# EasyEDA Pro project H桥.eprj

# Schematic 单相_直插
Board Name: 单相_直插; Create Date: 2025-08-05; Page Name: P1; Project Name: H桥; Schematic Name: 单相_直插; Update Date: 2025-08-12; Company: 嘉立创EDA; Page Size: A4; Version: V1.0
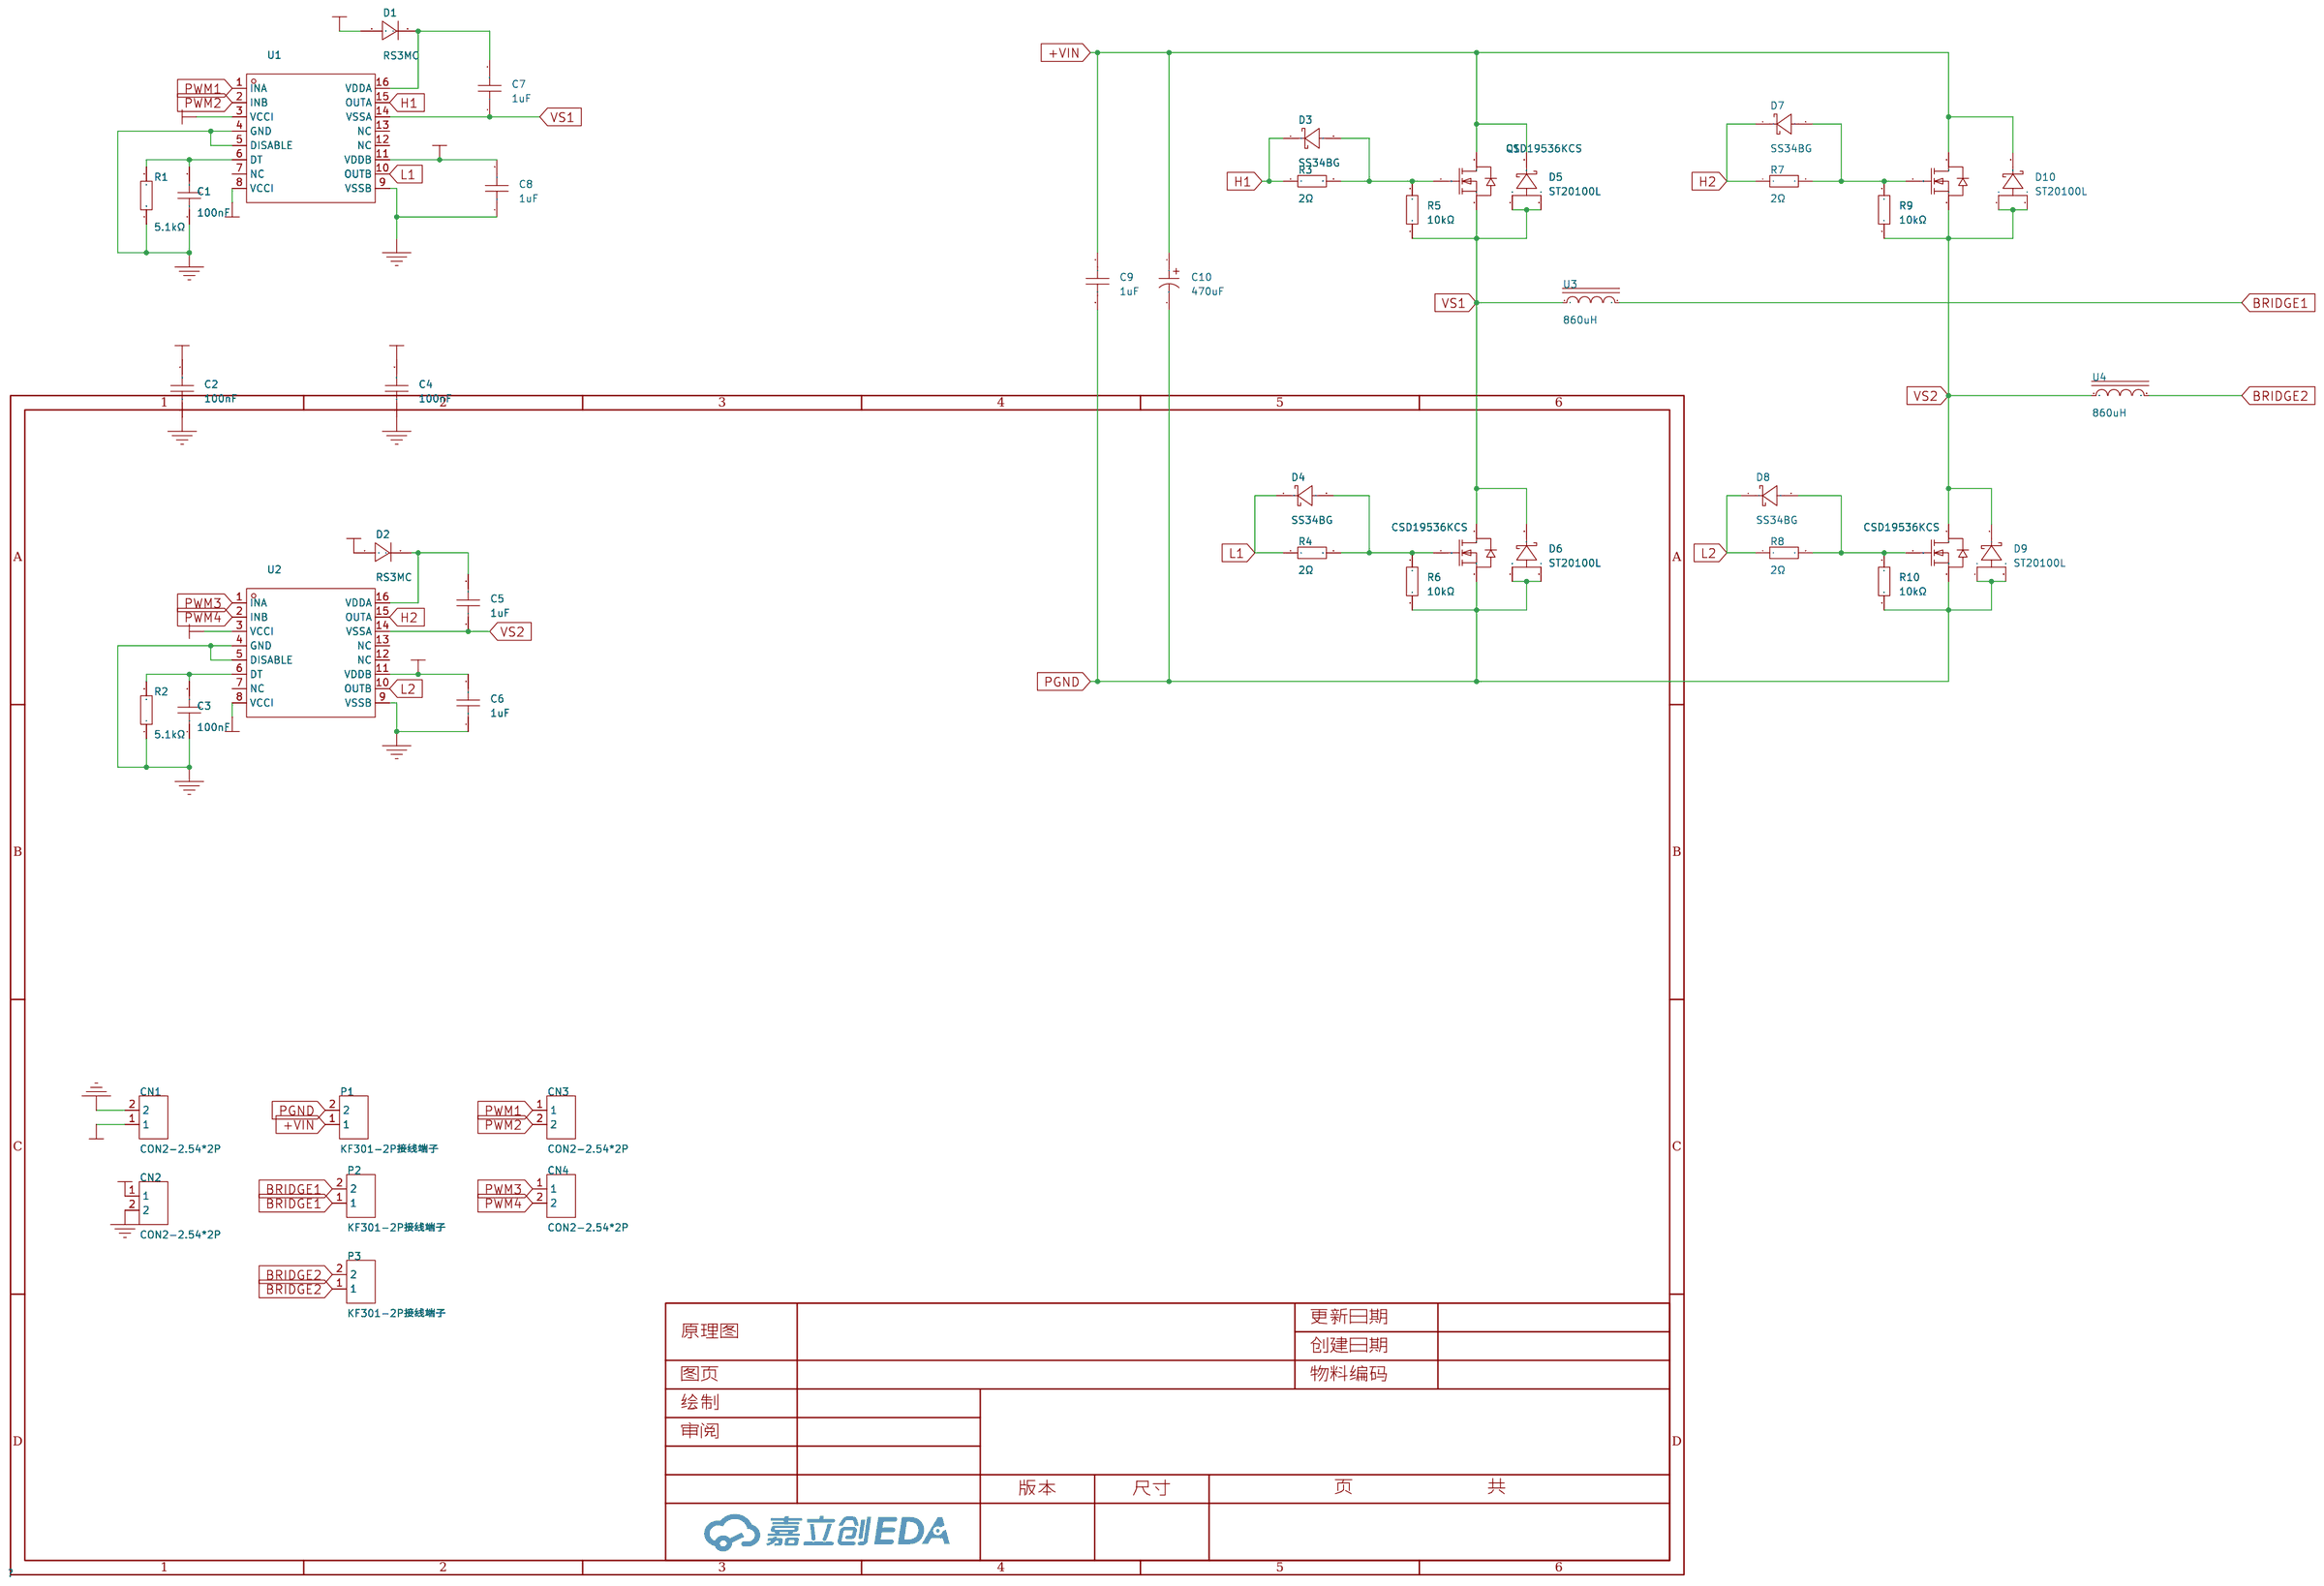
[diagram p0: schematic sheet]

## Parts
C1  100nF  [C0805]
C2  100nF  [C0805]
C3  100nF  [C0805]
C4  100nF  [C0805]
C5  1uF  [C0805]
C6  1uF  [C0805]
C7  1uF  [C0805]
C8  1uF  [C0805]
C9  1uF  [CAP-TH_L26.5-W10.0-P22.50-D1.4]
C10  470uF  [CAP-TH_BD16.0-P7.50-D1.2-FD]
CN1  CON2-2.54*2P  [CONN-TH_2P-P2.54-V]
CN2  CON2-2.54*2P  [CONN-TH_2P-P2.54-V]
CN3  CON2-2.54*2P  [CONN-TH_2P-P2.54-V]
CN4  CON2-2.54*2P  [CONN-TH_2P-P2.54-V]
D1  RS3MC  [SMC_L7.1-W6.2-LS8.1-R-RD]
D2  RS3MC  [SMC_L7.1-W6.2-LS8.1-R-RD]
D3  SS34BG  [SMB_L4.6-W3.6-LS5.3-RD]
D4  SS34BG  [SMB_L4.6-W3.6-LS5.3-RD]
D5  ST20100L  [TO-277_3P-L5.7-W4.2-LS6.5-BR]
D6  ST20100L  [TO-277_3P-L5.7-W4.2-LS6.5-BR]
D7  SS34BG  [SMB_L4.6-W3.6-LS5.3-RD]
D8  SS34BG  [SMB_L4.6-W3.6-LS5.3-RD]
D9  ST20100L  [TO-277_3P-L5.7-W4.2-LS6.5-BR]
D10  ST20100L  [TO-277_3P-L5.7-W4.2-LS6.5-BR]
P1  KF301-2P接线端子  [CONN-TH_XY301V-A-5.0-2P]
P2  KF301-2P接线端子  [CONN-TH_XY301V-A-5.0-2P]
P3  KF301-2P接线端子  [CONN-TH_XY301V-A-5.0-2P]
Q1  CSD19536KCS  [TO-220-3_L10.0-W4.5-P2.54-L]
Q2  CSD19536KCS  [TO-220-3_L10.0-W4.5-P2.54-L]
Q3  CSD19536KCS  [TO-220-3_L10.0-W4.5-P2.54-L]
Q4  CSD19536KCS  [TO-220-3_L10.0-W4.5-P2.54-L]
R1  20kΩ  [R0805]
R2  20kΩ  [R0805]
R3  2Ω  [R0805]
R4  2Ω  [R0805]
R5  10kΩ  [R0805]
R6  10kΩ  [R0805]
R7  2Ω  [R0805]
R8  2Ω  [R0805]
R9  10kΩ  [R0805]
R10  10kΩ  [R0805]
U1  UCC21520  [SOIC-16_L10.3-W7.5-P1.27-LS10.3-BL]
U2  UCC21520  [SOIC-16_L10.3-W7.5-P1.27-LS10.3-BL]
U3  860uH  [IND-TH_L29.0-W16.0-P14.00-D0.8]
U4  860uH  [IND-TH_L29.0-W16.0-P14.00-D0.8]

## Library data of the parts
C1 C3 = 1C25X7R473K100B: 容值:47nF;精度:±10%;额定电压:100V;温度系数:X7R;; LCSC Part Name: 47nF ±10% 100V; Supplier Part: C1630512; Manufacturer: VISHAY(威世); Supplier Footprint: 插件,P=6.35mm; JLCPCB Part Class: Extended Part; Datasheet: https://atta.szlcsc.com/upload/public/pdf/source/20210701/0CF1A7AD3406E72B391D35880AF61B15.pdf; Supplier: LCSC; Tolerance: ±10%; Voltage Rated: 100V; Temperature Coefficient: X7R
C2 C4-C8 = CAP_0805: Supplier Footprint: 0805
C9 = C322J474J90C000: LCSC Part Name: 470nF ±5% 630V; Supplier Part: C401319; Manufacturer: faratronic(厦门法拉); Supplier Footprint: 插件,P=22.5mm; JLCPCB Part Class: 扩展库; Datasheet: https://atta.szlcsc.com/upload/public/pdf/source/20190702/C401136_4E449A5F5E1485A05AFFA403AF8D4B3E.pdf; Supplier: LCSC; Tolerance: ±5%; Voltage Rated: 630V
C10 = CD11Z 100V470μF: 容值:470uF;额定电压:100V;纹波电流:-;等效串联电阻:-;; LCSC Part Name: 470uF 100V; Supplier Part: C1692765; Manufacturer: DMEGC(东磁); Supplier Footprint: 插件,D16xL25mm; JLCPCB Part Class: 扩展库; Datasheet: https://atta.szlcsc.com/upload/public/pdf/source/20210111/C1692765_3DA9E861BF574BA4CB3EF792989E2CF7.pdf; Supplier: LCSC; Rated Voltage: 100V
CN1-CN4 = CON2-2.54*2P: Supplier Part: C9900003238; Supplier Footprint: TH-2P; JLCPCB Part Class: Extended Part; Supplier: LCSC
D1 D2 = RS3MC_C15283: 二极管配置:独立式;正向压降(Vf):1.3V@3A;直流反向耐压(Vr):1kV;整流电流:3A;反向恢复时间(trr):500ns;; LCSC Part Name: 电压:1kV 电流:3A; Supplier Part: C15283; Manufacturer: MDD(辰达半导体); Supplier Footprint: SMC; JLCPCB Part Class: 扩展库; Datasheet: https://atta.szlcsc.com/upload/public/pdf/source/20240809/311FA8487617F5AA976E3BC15CA3A541.pdf; Supplier: LCSC; Diode Configuration: 独立式; Forward Voltage (Vf@If): 1.3V@3A; Reverse Voltage (Vr): 1kV; Rectified Current: 3A; Reverse Leakage Current: 5uA@1kV; Reverse Recovery Time (trr): 500ns; Operating Temperature: -55℃~+150℃@(Tj)
D3 D4 D7 D8 = SS34BG: LCSC Part Name: 电压:40V 电流:3A; Supplier Part: C719397; Manufacturer: SHIKUES(时科); Supplier Footprint: SMB; JLCPCB Part Class: 扩展库; Datasheet: https://atta.szlcsc.com/upload/public/pdf/source/20200825/C719396_E39605378EBDC67A0B7AD53C9B61FDD8.pdf; Supplier: LCSC; Diode Configuration: 独立式; Forward Voltage (Vf@If): 550mV@3A; Reverse Voltage (Vr): 40V; Average Rectified Current (Io): 3A; Reverse Leakage Current (Ir): 500uA@40V
D5 D6 D9 D10 = ST20100L: LCSC Part Name: 电压:100V 电流:20A; Supplier Part: C2693410; Manufacturer: CJ(江苏长电/长晶); Supplier Footprint: TO-277; JLCPCB Part Class: 扩展库; Datasheet: https://atta.szlcsc.com/upload/public/pdf/source/20210330/C2693410_9551F5ED840A67394421895091158B3C.pdf; Supplier: LCSC; Diode Configuration: 独立式; Voltage - Forward(Vf@If): 650mV@20A; Voltage - DC Reverse(Vr): 100V; Current - Rectified: 20A; Reverse Leakage Current (Ir): 30uA@100V
P1-P3 = KF301-2P接线端子: Supplier Part: C9900016950; Supplier Footprint: CK301-2P; JLCPCB Part Class: 扩展库; Supplier: LCSC
Q1-Q4 = CSD19536KCS: 类型:1个N沟道;漏源电压(Vdss):100V;连续漏极电流(Id):150A;功率(Pd):375W;导通电阻(RDS(on)@Vgs,Id):2.7mΩ@10V,100A;阈值电压(Vgs(th)@Id):3.2V@250uA;; LCSC Part Name: 1个N沟道 耐压:100V 电流:150A; Supplier Part: C206030; Manufacturer: TI(德州仪器); Supplier Footprint: TO-220; JLCPCB Part Class: 扩展库; Datasheet: https://www.ti.com/cn/lit/gpn/csd19536kcs; Supplier: LCSC; Type: 1个N沟道; Drain Source Voltage (Vdss): 100V; Continuous Drain Current (Id): 150A; Power Dissipation (Pd): 375W; Drain Source On Resistance (RDS(on)@Vgs,Id): 2.7mΩ@10V,100A; Gate Threshold Voltage (Vgs(th)@Id): 3.2V@250uA; Total Gate Charge (Qg@Vgs): 153nC@10V; Input Capacitance (Ciss@Vds): 12nF@50V; Operating Temperature: -55℃~+175℃@(Tj)
R1 R2 = 20kΩ: 电阻类型:金属膜电阻;阻值:20kΩ;精度:±1%;功率:500mW;温度系数:±50ppm/℃;; LCSC Part Name: 金属膜电阻 20kΩ ±1% 500mW; Supplier Part: C173146; Manufacturer: YAGEO(国巨); Manufacturer Part: MFR50SFTE52-20K; Supplier Footprint: 插件,D2.4xL6.3mm; JLCPCB Part Class: 扩展库; Datasheet: https://atta.szlcsc.com/upload/public/pdf/source/20191118/C457825_18355E864DE4965678DC27B0EBC3E21E.pdf; Supplier: LCSC; Type: 金属膜电阻; Tolerance: ±1%; Power(Watts): 500mW; Temperature Coefficient: ±50ppm/℃; Operating Temperature Range: -55℃~+155℃; Origin Footprint 2: RES-TH_BD2.4-L6.3-P10.30-D0.6; Origin Footprint 1: MFR50SFTE52-20K
R3-R10 = Res_AXIAL-1/8W: Supplier Footprint: 轴向引线
U1 U2 = UCC21520: Supplier: LCSC; Supplier Part: C601651; Manufacturer: TI(德州仪器); JLCPCB Part Class: Extended Part
U3 U4 = YDTC90125-861L: LCSC Part Name: TC90125 860uH@10KHz 150mΩ 3A; Supplier Part: C22395844; Manufacturer: YJYCOIN(益嘉源); Supplier Footprint: 插件,P=14mm; Datasheet: https://atta.szlcsc.com/upload/public/pdf/source/20240511/73FAF6FE8F8F84F1808BB18923905892.pdf; Supplier: LCSC; Tolerance: ±20%

## Nets
+5V: C2.2 CN2.1 U1.3(VCCI) U1.8(VCCI) U2.3(VCCI) U2.8(VCCI)
+12V: C4.2 C6.2 C8.2 CN1.1 D1.1(A) D2.1(A) U1.11(VDDB) U2.11(VDDB)
+VIN: C9.1 C10.1 D5.2(K) D10.2(K) P1.1 Q1.2(D) Q3.2(D)
DGND: C1.1 C2.1 C3.1 CN2.2 R1.1 R2.1 U1.4(GND) U1.5(DISABLE) U2.4(GND) U2.5(DISABLE)
PGND: C4.1 C6.1 C8.1 C9.2 C10.2 CN1.2 D6.1(A) D6.3(A) D9.1(A) D9.3(A) P1.2 Q2.3(S) Q4.3(S) R6.1 R10.1 U1.9(VSSB) U2.9(VSSB)
BRIDGE1: P2.1 P2.2 U3.2
BRIDGE2: P3.1 P3.2 U4.2
H1: D3.1(K) R3.1 U1.15(OUTA)
H2: D7.1(K) R7.1 U2.15(OUTA)
L1: D4.1(K) R4.1 U1.10(OUTB)
L2: D8.1(K) R8.1 U2.10(OUTB)
PWM1: CN3.1 U1.1(INA)
PWM2: CN3.2 U1.2(INB)
PWM3: CN4.1 U2.1(INA)
PWM4: CN4.2 U2.2(INB)
VS1: C7.1 D5.1(A) D5.3(A) D6.2(K) Q1.3(S) Q2.2(D) R5.1 U1.14(VSSA) U3.1
VS2: C5.1 D9.2(K) D10.1(A) D10.3(A) Q3.3(S) Q4.2(D) R9.1 U2.14(VSSA) U4.1
$1N1918: D4.2(A) Q2.1(G) R4.2 R6.2
$1N1920: D3.2(A) Q1.1(G) R3.2 R5.2
$1N1922: D7.2(A) Q3.1(G) R7.2 R9.2
$1N1924: D8.2(A) Q4.1(G) R8.2 R10.2
$1N1931: C3.2 R2.2 U2.6(DT)
$1N1939: C1.2 R1.2 U1.6(DT)
$1N1949: C5.2 D2.2(K) U2.16(VDDA)
$1N1950: C7.2 D1.2(K) U1.16(VDDA)

Not connected (* = marked no-connect by the designer): U1 7(NC) 12(NC) 13(NC); U2 7(NC) 12(NC) 13(NC)

# Schematic 单相_贴片
Board Name: 单相_贴片; Create Date: 2025-08-14; Page Name: P1; Project Name: H桥; Schematic Name: 单相_贴片; Update Date: 2025-08-14; Company: 嘉立创EDA; Page Size: A4; Version: V1.0
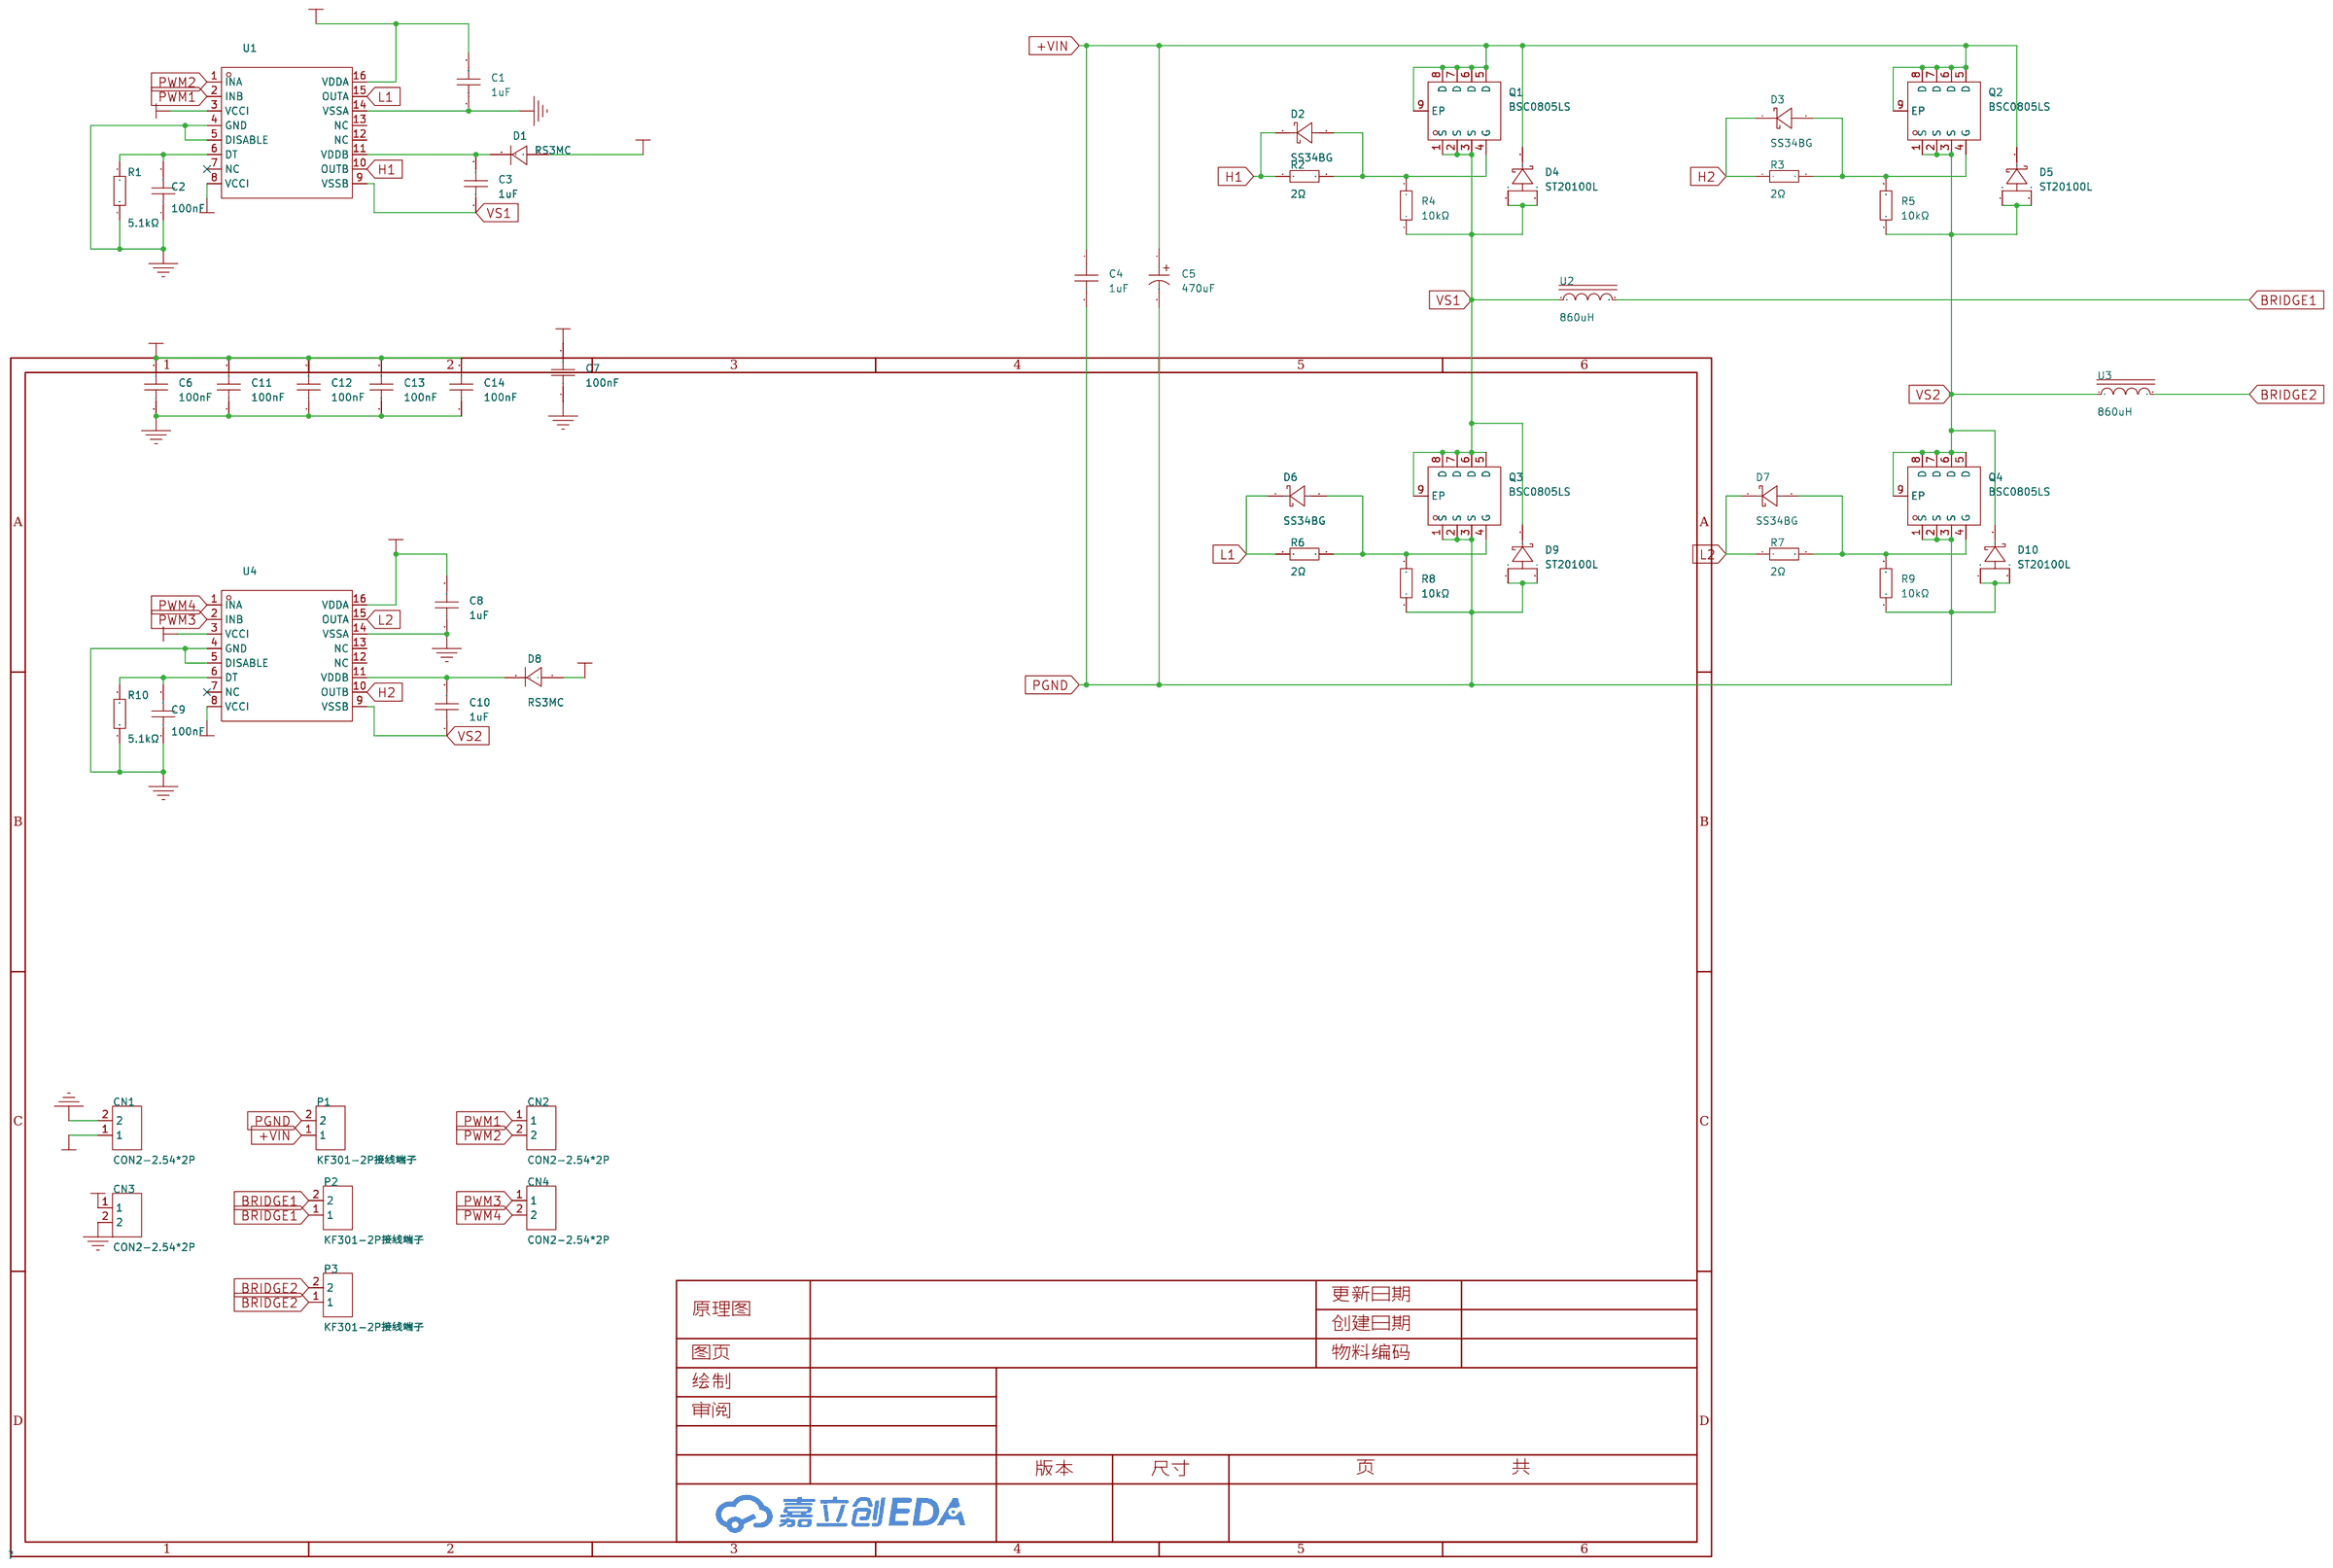
[diagram p1: schematic sheet]

## Parts
C1  1uF  [C0805]
C2  100nF  [C0805]
C3  1uF  [C0805]
C4  1uF  [CAP-TH_L26.5-W10.0-P22.50-D1.4]
C5  470uF  [CAP-TH_BD16.0-P7.50-D1.2-FD]
C6  100nF  [C0805]
C7  100nF  [C0805]
C8  1uF  [C0805]
C9  100nF  [C0805]
C10  1uF  [C0805]
C11  100nF  [C0805]
C12  100nF  [C0805]
C13  100nF  [C0805]
C14  100nF  [C0805]
CN1  CON2-2.54*2P  [CONN-TH_2P-P2.54-V]
CN2  CON2-2.54*2P  [CONN-TH_2P-P2.54-V]
CN3  CON2-2.54*2P  [CONN-TH_2P-P2.54-V]
CN4  CON2-2.54*2P  [CONN-TH_2P-P2.54-V]
D1  RS3MC  [SMC_L7.1-W6.2-LS8.1-R-RD]
D2  SS34BG  [SMB_L4.6-W3.6-LS5.3-RD]
D3  SS34BG  [SMB_L4.6-W3.6-LS5.3-RD]
D4  ST20100L  [TO-277_3P-L5.7-W4.2-LS6.5-BR]
D5  ST20100L  [TO-277_3P-L5.7-W4.2-LS6.5-BR]
D6  SS34BG  [SMB_L4.6-W3.6-LS5.3-RD]
D7  SS34BG  [SMB_L4.6-W3.6-LS5.3-RD]
D8  RS3MC  [SMC_L7.1-W6.2-LS8.1-R-RD]
D9  ST20100L  [TO-277_3P-L5.7-W4.2-LS6.5-BR]
D10  ST20100L  [TO-277_3P-L5.7-W4.2-LS6.5-BR]
P1  KF301-2P接线端子  [CONN-TH_XY301V-A-5.0-2P]
P2  KF301-2P接线端子  [CONN-TH_XY301V-A-5.0-2P]
P3  KF301-2P接线端子  [CONN-TH_XY301V-A-5.0-2P]
Q1  BSC0805LS  [PG-TDSON-8_L5.2-W5.9-P1.27-LS6.2-BL-EP]
Q2  BSC0805LS  [PG-TDSON-8_L5.2-W5.9-P1.27-LS6.2-BL-EP]
Q3  BSC0805LS  [PG-TDSON-8_L5.2-W5.9-P1.27-LS6.2-BL-EP]
Q4  BSC0805LS  [PG-TDSON-8_L5.2-W5.9-P1.27-LS6.2-BL-EP]
R1  20kΩ  [R0805]
R2  2Ω  [R0805]
R3  2Ω  [R0805]
R4  10kΩ  [R0805]
R5  10kΩ  [R0805]
R6  2Ω  [R0805]
R7  2Ω  [R0805]
R8  10kΩ  [R0805]
R9  10kΩ  [R0805]
R10  20kΩ  [R0805]
U1  UCC21520  [SOIC-16_L10.3-W7.5-P1.27-LS10.3-BL]
U2  860uH  [IND-TH_L29.0-W16.0-P14.00-D0.8]
U3  860uH  [IND-TH_L29.0-W16.0-P14.00-D0.8]
U4  UCC21520  [SOIC-16_L10.3-W7.5-P1.27-LS10.3-BL]

## Library data of the parts
C1 C3 C6-C8 C10-C14 = CAP_0805: Supplier Footprint: 0805
C2 C9 = 1C25X7R473K100B: 容值:47nF;精度:±10%;额定电压:100V;温度系数:X7R;; LCSC Part Name: 47nF ±10% 100V; Supplier Part: C1630512; Manufacturer: VISHAY(威世); Supplier Footprint: 插件,P=6.35mm; JLCPCB Part Class: Extended Part; Datasheet: https://atta.szlcsc.com/upload/public/pdf/source/20210701/0CF1A7AD3406E72B391D35880AF61B15.pdf; Supplier: LCSC; Tolerance: ±10%; Voltage Rated: 100V; Temperature Coefficient: X7R
C4 = C322J474J90C000: LCSC Part Name: 470nF ±5% 630V; Supplier Part: C401319; Manufacturer: faratronic(厦门法拉); Supplier Footprint: 插件,P=22.5mm; JLCPCB Part Class: 扩展库; Datasheet: https://atta.szlcsc.com/upload/public/pdf/source/20190702/C401136_4E449A5F5E1485A05AFFA403AF8D4B3E.pdf; Supplier: LCSC; Tolerance: ±5%; Voltage Rated: 630V
C5 = CD11Z 100V470μF: 容值:470uF;额定电压:100V;纹波电流:-;等效串联电阻:-;; LCSC Part Name: 470uF 100V; Supplier Part: C1692765; Manufacturer: DMEGC(东磁); Supplier Footprint: 插件,D16xL25mm; JLCPCB Part Class: 扩展库; Datasheet: https://atta.szlcsc.com/upload/public/pdf/source/20210111/C1692765_3DA9E861BF574BA4CB3EF792989E2CF7.pdf; Supplier: LCSC; Rated Voltage: 100V
CN1-CN4 = CON2-2.54*2P: Supplier Part: C9900003238; Supplier Footprint: TH-2P; JLCPCB Part Class: Extended Part; Supplier: LCSC
D1 D8 = RS3MC_C15283: 二极管配置:独立式;正向压降(Vf):1.3V@3A;直流反向耐压(Vr):1kV;整流电流:3A;反向恢复时间(trr):500ns;; LCSC Part Name: 电压:1kV 电流:3A; Supplier Part: C15283; Manufacturer: MDD(辰达半导体); Supplier Footprint: SMC; JLCPCB Part Class: 扩展库; Datasheet: https://atta.szlcsc.com/upload/public/pdf/source/20240809/311FA8487617F5AA976E3BC15CA3A541.pdf; Supplier: LCSC; Diode Configuration: 独立式; Forward Voltage (Vf@If): 1.3V@3A; Reverse Voltage (Vr): 1kV; Rectified Current: 3A; Reverse Leakage Current: 5uA@1kV; Reverse Recovery Time (trr): 500ns; Operating Temperature: -55℃~+150℃@(Tj)
D2 D3 D6 D7 = SS34BG: LCSC Part Name: 电压:40V 电流:3A; Supplier Part: C719397; Manufacturer: SHIKUES(时科); Supplier Footprint: SMB; JLCPCB Part Class: 扩展库; Datasheet: https://atta.szlcsc.com/upload/public/pdf/source/20200825/C719396_E39605378EBDC67A0B7AD53C9B61FDD8.pdf; Supplier: LCSC; Diode Configuration: 独立式; Forward Voltage (Vf@If): 550mV@3A; Reverse Voltage (Vr): 40V; Average Rectified Current (Io): 3A; Reverse Leakage Current (Ir): 500uA@40V
D4 D5 D9 D10 = ST20100L: LCSC Part Name: 电压:100V 电流:20A; Supplier Part: C2693410; Manufacturer: CJ(江苏长电/长晶); Supplier Footprint: TO-277; JLCPCB Part Class: 扩展库; Datasheet: https://atta.szlcsc.com/upload/public/pdf/source/20210330/C2693410_9551F5ED840A67394421895091158B3C.pdf; Supplier: LCSC; Diode Configuration: 独立式; Voltage - Forward(Vf@If): 650mV@20A; Voltage - DC Reverse(Vr): 100V; Current - Rectified: 20A; Reverse Leakage Current (Ir): 30uA@100V
P1-P3 = KF301-2P接线端子: Supplier Part: C9900016950; Supplier Footprint: CK301-2P; JLCPCB Part Class: 扩展库; Supplier: LCSC
Q1-Q4 = BSC0805LS: LCSC Part Name: 1个N沟道 耐压:100V 电流:61A; Supplier Part: C534374; Manufacturer: Infineon(英飞凌); Supplier Footprint: TDSON-8(5x6); JLCPCB Part Class: 扩展库; Datasheet: https://atta.szlcsc.com/upload/public/pdf/source/20200515/C534374_66950A10506F19F261C25E6ECF73BC74.pdf; Supplier: LCSC; Number: 1个N沟道; Drain to Source Voltage: 100V; Current - Continuous Drain(Id): 61A; Pd - Power Dissipation: 2.5W; Gate Threshold Voltage (Vgs(th)): 2.3V; Gate Charge(Qg): 16nC; Input Capacitance(Ciss): 2.7nF@50V; Reverse Transfer Capacitance (Crss@Vds): 28pF@50V; Operating Temperature: -55℃~+150℃
R1 R10 = 20kΩ: 电阻类型:金属膜电阻;阻值:20kΩ;精度:±1%;功率:500mW;温度系数:±50ppm/℃;; LCSC Part Name: 金属膜电阻 20kΩ ±1% 500mW; Supplier Part: C173146; Manufacturer: YAGEO(国巨); Manufacturer Part: MFR50SFTE52-20K; Supplier Footprint: 插件,D2.4xL6.3mm; JLCPCB Part Class: 扩展库; Datasheet: https://atta.szlcsc.com/upload/public/pdf/source/20191118/C457825_18355E864DE4965678DC27B0EBC3E21E.pdf; Supplier: LCSC; Type: 金属膜电阻; Tolerance: ±1%; Power(Watts): 500mW; Temperature Coefficient: ±50ppm/℃; Operating Temperature Range: -55℃~+155℃; Origin Footprint 2: RES-TH_BD2.4-L6.3-P10.30-D0.6; Origin Footprint 1: MFR50SFTE52-20K
R2-R9 = Res_AXIAL-1/8W: Supplier Footprint: 轴向引线
U1 U4 = UCC21520: Supplier: LCSC; Supplier Part: C601651; Manufacturer: TI(德州仪器); JLCPCB Part Class: Extended Part
U2 U3 = YDTC90125-861L: LCSC Part Name: TC90125 860uH@10KHz 150mΩ 3A; Supplier Part: C22395844; Manufacturer: YJYCOIN(益嘉源); Supplier Footprint: 插件,P=14mm; Datasheet: https://atta.szlcsc.com/upload/public/pdf/source/20240511/73FAF6FE8F8F84F1808BB18923905892.pdf; Supplier: LCSC; Tolerance: ±20%

## Nets
+5V: C6.2 C11.2 C12.2 C13.2 C14.2 CN3.1 U1.3(VCCI) U1.8(VCCI) U4.3(VCCI) U4.8(VCCI)
+12V: C1.2 C7.2 C8.2 CN1.1 D1.1(A) D8.1(A) U1.16(VDDA) U4.16(VDDA)
+VIN: C4.1 C5.1 D4.2(K) D5.2(K) P1.1 Q1.5(D) Q1.6(D) Q1.7(D) Q1.8(D) Q1.9(EP) Q2.5(D) Q2.6(D) Q2.7(D) Q2.8(D) Q2.9(EP)
DGND: C2.1 C6.1 C9.1 C11.1 C12.1 C13.1 C14.1 CN3.2 R1.1 R10.1 U1.4(GND) U1.5(DISABLE) U4.4(GND) U4.5(DISABLE)
PGND: C1.1 C4.2 C5.2 C7.1 C8.1 CN1.2 D9.1(A) D9.3(A) D10.1(A) D10.3(A) P1.2 Q3.1(S) Q3.2(S) Q3.3(S) Q4.1(S) Q4.2(S) Q4.3(S) R8.1 R9.1 U1.14(VSSA) U4.14(VSSA)
BRIDGE1: P2.1 P2.2 U2.2
BRIDGE2: P3.1 P3.2 U3.2
H1: D2.1(K) R2.1 U1.10(OUTB)
H2: D3.1(K) R3.1 U4.10(OUTB)
L1: D6.1(K) R6.1 U1.15(OUTA)
L2: D7.1(K) R7.1 U4.15(OUTA)
PWM1: CN2.1 U1.2(INB)
PWM2: CN2.2 U1.1(INA)
PWM3: CN4.1 U4.2(INB)
PWM4: CN4.2 U4.1(INA)
VS1: C3.1 D4.1(A) D4.3(A) D9.2(K) Q1.1(S) Q1.2(S) Q1.3(S) Q3.5(D) Q3.6(D) Q3.7(D) Q3.8(D) Q3.9(EP) R4.1 U1.9(VSSB) U2.1
VS2: C10.1 D5.1(A) D5.3(A) D10.2(K) Q2.1(S) Q2.2(S) Q2.3(S) Q4.5(D) Q4.6(D) Q4.7(D) Q4.8(D) Q4.9(EP) R5.1 U3.1 U4.9(VSSB)
$1N2033: D6.2(A) Q3.4(G) R6.2 R8.2
$1N2035: D2.2(A) Q1.4(G) R2.2 R4.2
$1N2037: D3.2(A) Q2.4(G) R3.2 R5.2
$1N2039: D7.2(A) Q4.4(G) R7.2 R9.2
$1N2046: C9.2 R10.2 U4.6(DT)
$1N2049: C3.2 D1.2(K) U1.11(VDDB)
$1N2054: C2.2 R1.2 U1.6(DT)
$1N4233: C10.2 D8.2(K) U4.11(VDDB)

Not connected (* = marked no-connect by the designer): U1 7(NC)* 12(NC) 13(NC); U4 7(NC)* 12(NC) 13(NC)

# Schematic 单相_GaN
Board Name: 单相_GaN; Create Date: 2025-08-14; Page Name: P1; Project Name: H桥; Schematic Name: 单相_GaN; Update Date: 2025-08-15; Company: 嘉立创EDA; Page Size: A4; Version: V1.0
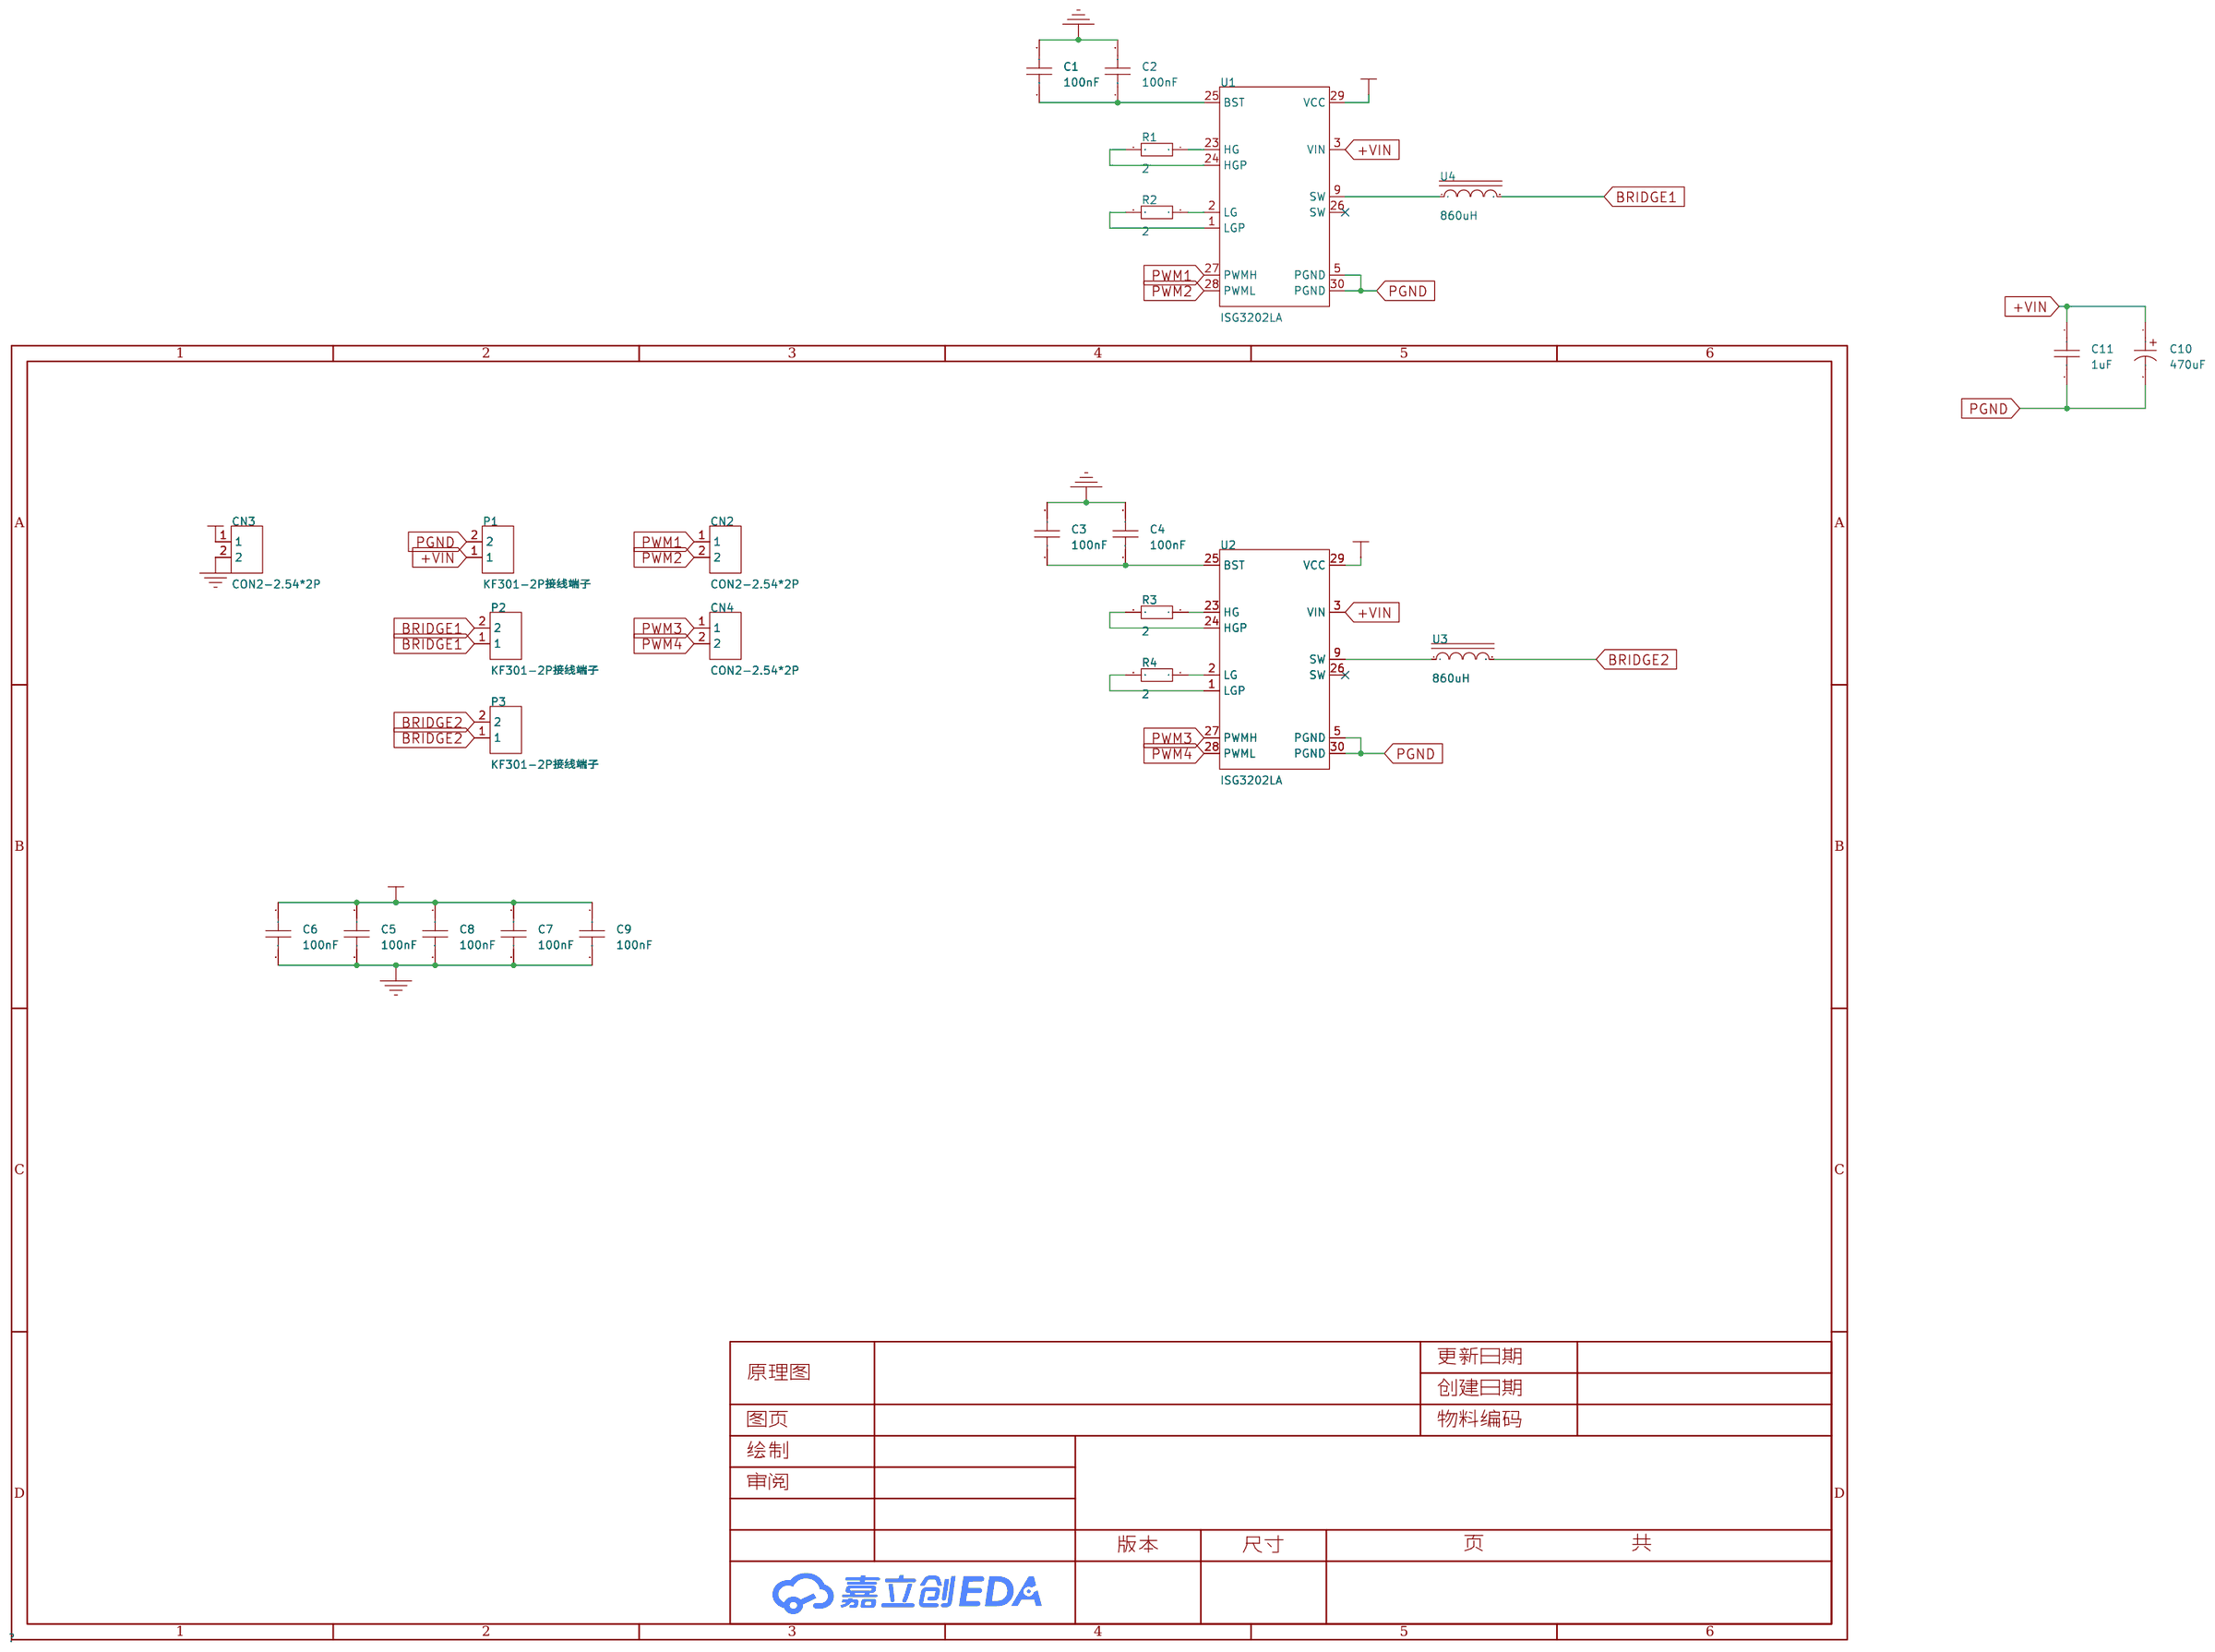
[diagram p2: schematic sheet]

## Parts
C1  100nF  [C0805]
C2  100nF  [C0805]
C3  100nF  [C0805]
C4  100nF  [C0805]
C5  100nF  [C0805]
C6  100nF  [C0805]
C7  100nF  [C0805]
C8  100nF  [C0805]
C9  100nF  [C0805]
C10  470uF  [CAP-TH_BD16.0-P7.50-D1.2-FD]
C11  1uF  [CAP-TH_L26.5-W10.0-P22.50-D1.4]
CN2  CON2-2.54*2P  [CONN-TH_2P-P2.54-V]
CN3  CON2-2.54*2P  [CONN-TH_2P-P2.54-V]
CN4  CON2-2.54*2P  [CONN-TH_2P-P2.54-V]
P1  KF301-2P接线端子  [CONN-TH_XY301V-A-5.0-2P]
P2  KF301-2P接线端子  [CONN-TH_XY301V-A-5.0-2P]
P3  KF301-2P接线端子  [CONN-TH_XY301V-A-5.0-2P]
R1  2  [R0805]
R2  2  [R0805]
R3  2  [R0805]
R4  2  [R0805]
U1  ISG3202LA  [LGA-25_L6.5-W5.0-P0.85-TL]
U2  ISG3202LA  [LGA-25_L6.5-W5.0-P0.85-TL]
U3  860uH  [IND-TH_L29.0-W16.0-P14.00-D0.8]
U4  860uH  [IND-TH_L29.0-W16.0-P14.00-D0.8]

## Library data of the parts
C1-C9 = CAP_0805: Supplier Footprint: 0805
C10 = CD11Z 100V470μF: 容值:470uF;额定电压:100V;纹波电流:-;等效串联电阻:-;; LCSC Part Name: 470uF 100V; Supplier Part: C1692765; Manufacturer: DMEGC(东磁); Supplier Footprint: 插件,D16xL25mm; JLCPCB Part Class: 扩展库; Datasheet: https://atta.szlcsc.com/upload/public/pdf/source/20210111/C1692765_3DA9E861BF574BA4CB3EF792989E2CF7.pdf; Supplier: LCSC; Rated Voltage: 100V
C11 = C322J474J90C000: LCSC Part Name: 470nF ±5% 630V; Supplier Part: C401319; Manufacturer: faratronic(厦门法拉); Supplier Footprint: 插件,P=22.5mm; JLCPCB Part Class: 扩展库; Datasheet: https://atta.szlcsc.com/upload/public/pdf/source/20190702/C401136_4E449A5F5E1485A05AFFA403AF8D4B3E.pdf; Supplier: LCSC; Tolerance: ±5%; Voltage Rated: 630V
CN2-CN4 = CON2-2.54*2P: Supplier Part: C9900003238; Supplier Footprint: TH-2P; JLCPCB Part Class: Extended Part; Supplier: LCSC
P1-P3 = KF301-2P接线端子: Supplier Part: C9900016950; Supplier Footprint: CK301-2P; JLCPCB Part Class: 扩展库; Supplier: LCSC
R1-R4 = Res_0805: Supplier Footprint: 0805
U1 U2 = ISG3202LA_C41417827: LCSC Part Name: *半导体*晶体管; Supplier Part: C41417827; Manufacturer: Innoscience(英诺赛科); Supplier Footprint: LGA-30(5x6.5); Datasheet: https://atta.szlcsc.com/upload/public/pdf/source/20250630/71E393AD9F021D1FA26E514C64E44E0B.pdf; Supplier: LCSC
U3 U4 = YDTC90125-861L: LCSC Part Name: TC90125 860uH@10KHz 150mΩ 3A; Supplier Part: C22395844; Manufacturer: YJYCOIN(益嘉源); Supplier Footprint: 插件,P=14mm; Datasheet: https://atta.szlcsc.com/upload/public/pdf/source/20240511/73FAF6FE8F8F84F1808BB18923905892.pdf; Supplier: LCSC; Tolerance: ±20%

## Nets
+5V: C5.1 C6.1 C7.1 C8.1 C9.1 CN3.1 U1.29(VCC) U2.29(VCC)
+VIN: C10.1 C11.1 P1.1 U1.3(VIN) U2.3(VIN)
PGND: C1.2 C2.2 C3.2 C4.2 C5.2 C6.2 C7.2 C8.2 C9.2 C10.2 C11.2 CN3.2 P1.2 U1.5(PGND) U1.30(PGND) U2.5(PGND) U2.30(PGND)
BRIDGE1: P2.1 P2.2 U4.2
BRIDGE2: P3.1 P3.2 U3.2
PWM1: CN2.1 U1.27(PWMH)
PWM2: CN2.2 U1.28(PWML)
PWM3: CN4.1 U2.27(PWMH)
PWM4: CN4.2 U2.28(PWML)
$1N1496: U2.9(SW) U3.1
$1N1511: U1.9(SW) U4.1
$1N1932: R1.1 U1.23(HG)
$1N1936: R1.2 U1.24(HGP)
$1N1943: R2.1 U1.2(LG)
$1N1948: R2.2 U1.1(LGP)
$1N2001: R3.1 U2.23(HG)
$1N2003: R3.2 U2.24(HGP)
$1N2007: R4.1 U2.2(LG)
$1N2009: R4.2 U2.1(LGP)
$1N2087: C1.1 C2.1 U1.25(BST)
$1N2168: C3.1 C4.1 U2.25(BST)

Not connected (* = marked no-connect by the designer): U1 26(SW)*; U2 26(SW)*

# Board 单相_直插
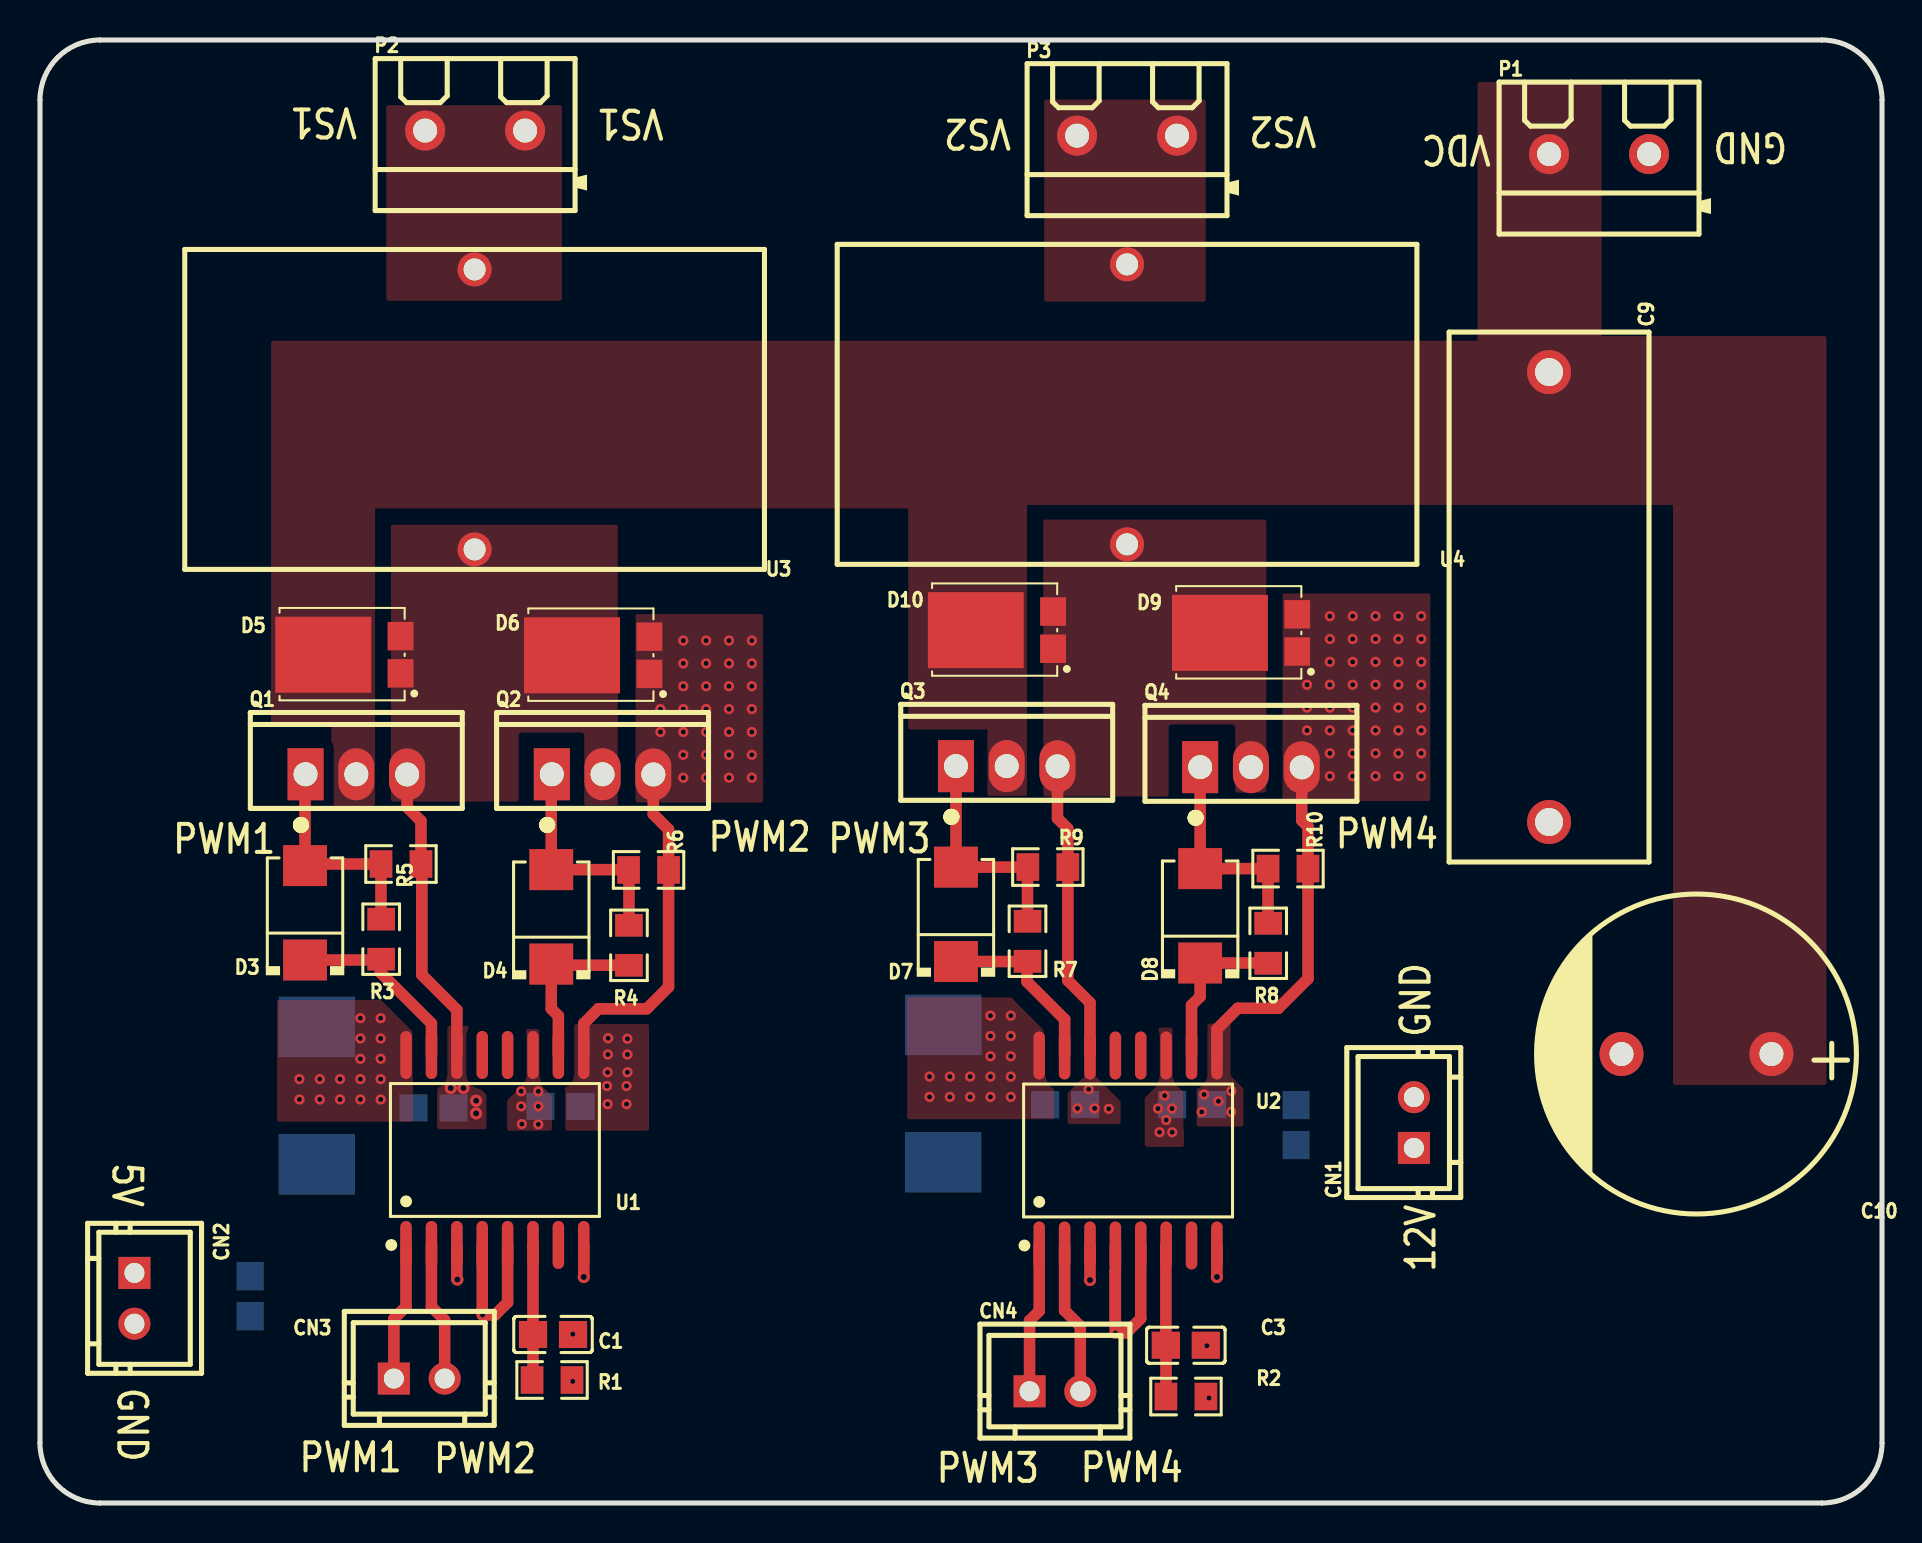
[diagram p3: board, top side]
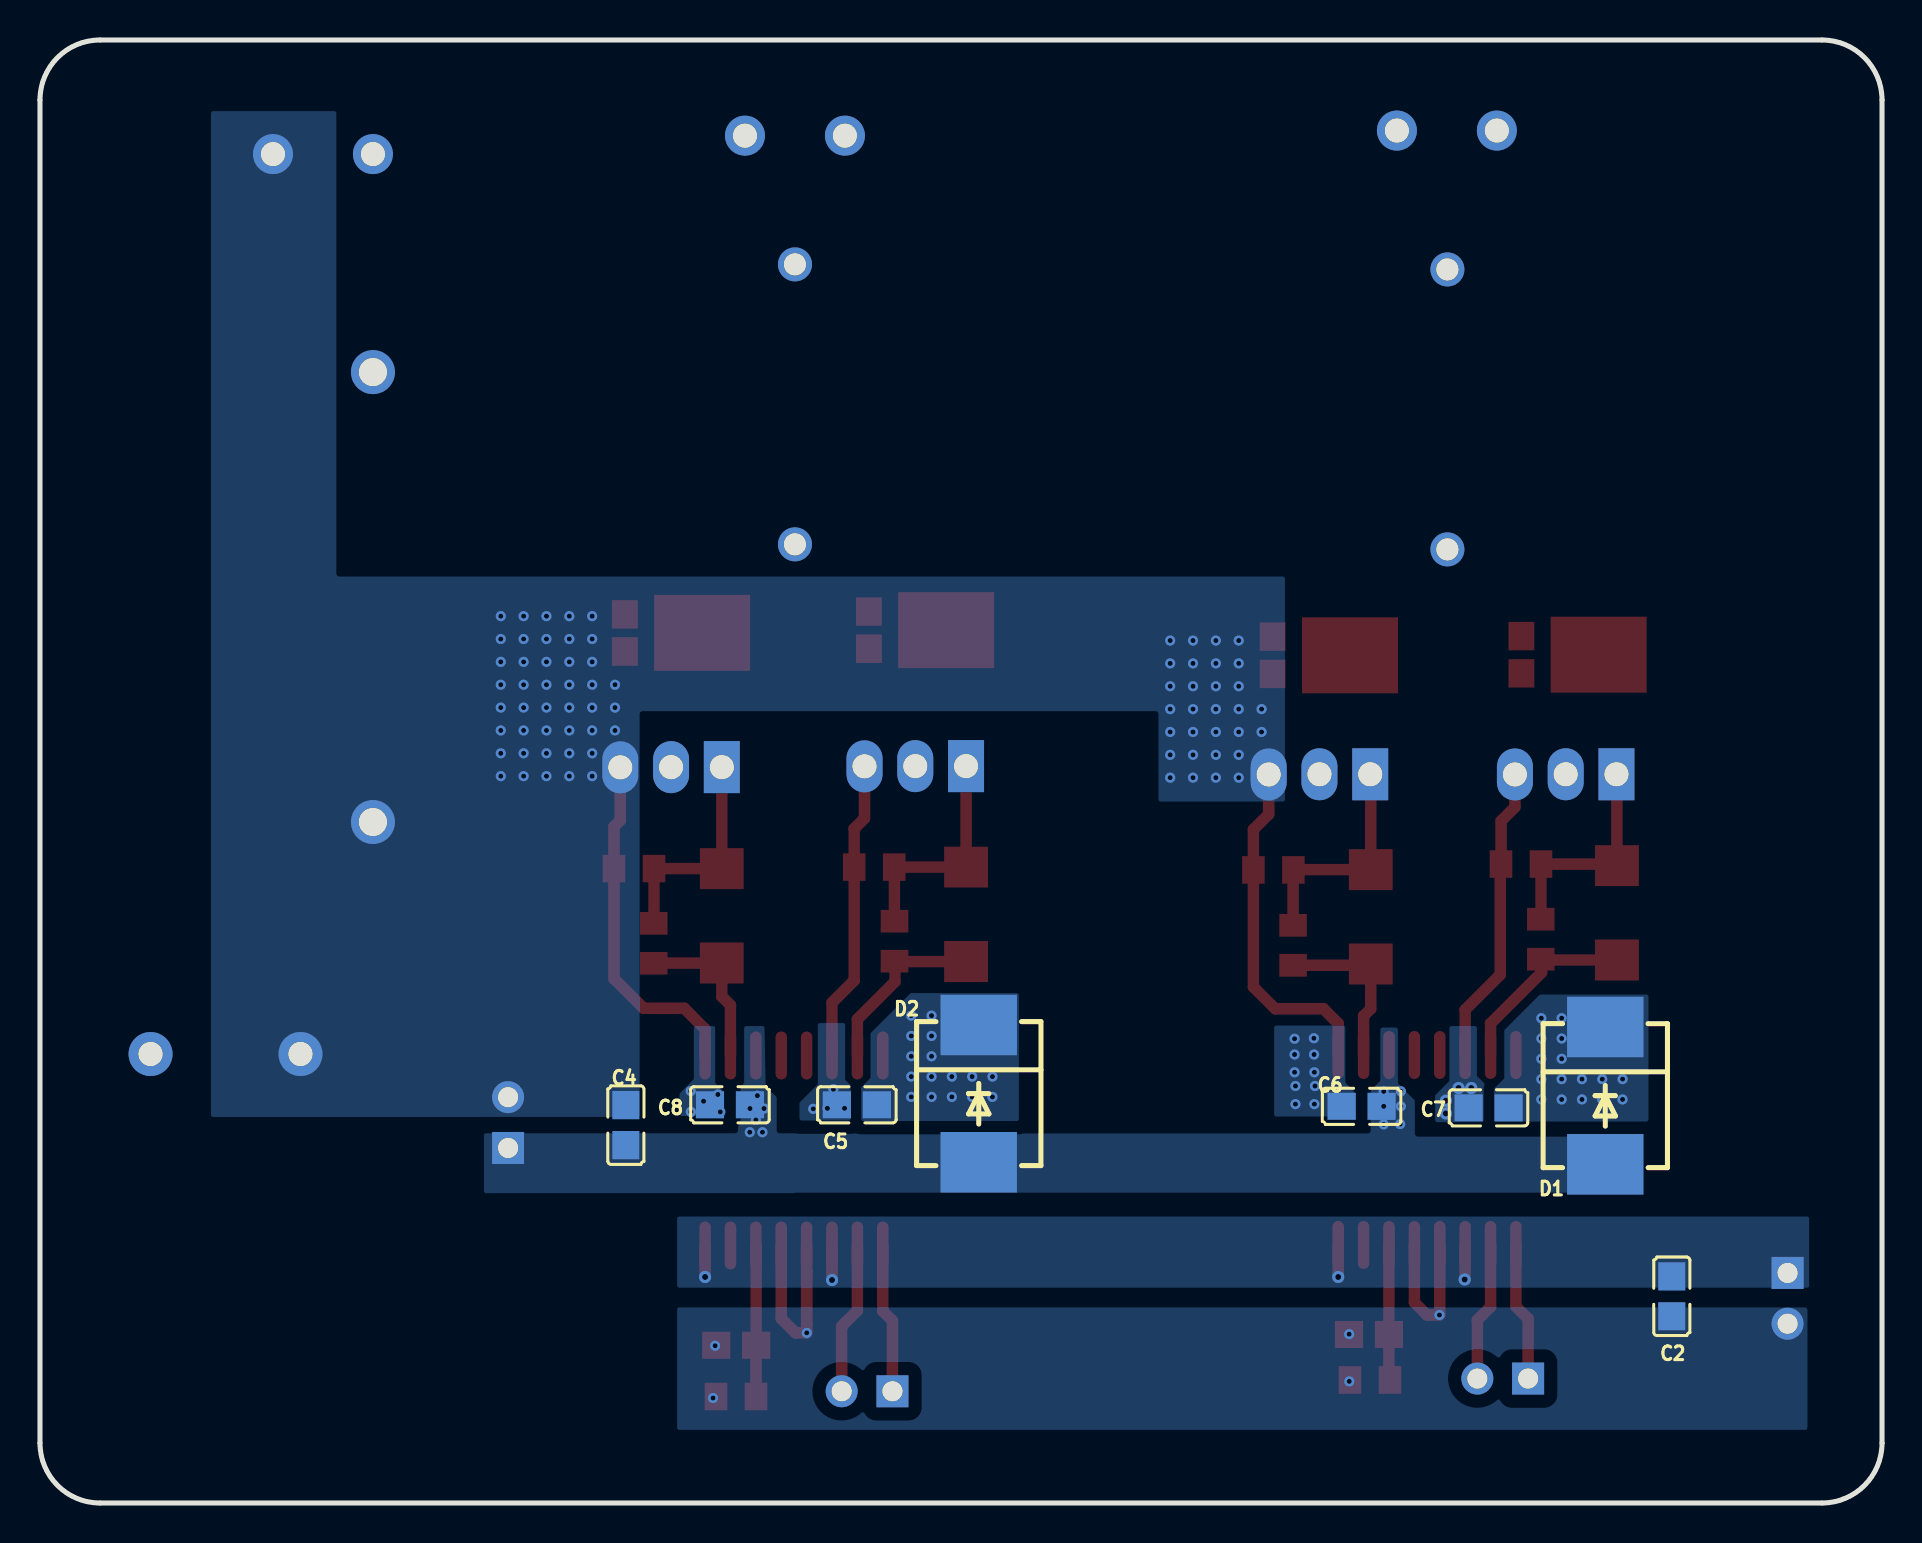
[diagram p4: board, bottom side, seen from below]

Outline 92.15 x 73.16 mm; copper layers: Top Layer, Bottom Layer. Coordinates in mm from the lower left corner of the outline.
Outline path: 0,70.16 0,3 arc(0.88,0.88) 3,0 89.15,0 arc(91.27,0.88) 92.15,3 92.15,70.16 arc(91.27,72.28) 89.15,73.16 3,73.16 arc(0.88,72.28) 0,70.16
Stack: Top Layer 0.035mm / Dielectric1 1.51mm FR4 er 4.5 / Bottom Layer 0.035mm

## Design rules (mm)
template: 自定义配置
spacing copperThickness1oz (default): track to track 0.508, other pairs 0.508 to 0.508
spacing copperThickness2oz: track to track 0.203, other pairs 0.152 to 0.3
track width copperThickness1oz (default): min 0.127, default 0.254, max 2.54
track width copperThickness2oz: min 0.203, default 0.254, max 2.54
differential pair differentialPair (default): width min 0.127, default 0.254, max 2.54; gap min 0.152, default 0.152
via viaSize (default): diameter min 0.5, default 0.508, max 10; hole min 0.127, default 0.254, max 6.3

## Placement (name value [footprint] x y rotation side)
C1  100nF  [C0805]  25.67 8.43 180 top
C2  100nF  [C0805]  10.52 10.34 90 bottom
C3  100nF  [C0805]  57.32 7.89 180 top
C4  100nF  [C0805]  62.84 18.9 270 bottom
C5  1uF  [C0805]  51.28 19.91 180 bottom
C6  1uF  [C0805]  26.03 19.84 180 bottom
C7  1uF  [C0805]  19.69 19.76 180 bottom
C8  1uF  [C0805]  57.63 19.91 180 bottom
C9  1uF  [CAP-TH_L26.5-W10.0-P22.50-D1.4]  75.49 45.3 270 top
C10  470uF  [CAP-TH_BD16.0-P7.50-D1.2-FD]  82.87 22.45 180 top
CN1  CON2-2.54*2P  [CONN-TH_2P-P2.54-V]  68.73 19.02 90 top
CN2  CON2-2.54*2P  [CONN-TH_2P-P2.54-V]  4.72 10.24 270 top
CN3  CON2-2.54*2P  [CONN-TH_2P-P2.54-V]  18.97 6.22 0 top
CN4  CON2-2.54*2P  [CONN-TH_2P-P2.54-V]  50.77 5.59 0 top
D1  RS3MC  [SMC_L7.1-W6.2-LS8.1-R-RD]  13.84 20.37 270 bottom
D2  RS3MC  [SMC_L7.1-W6.2-LS8.1-R-RD]  45.19 20.47 270 bottom
D3  SS34BG  [SMB_L4.6-W3.6-LS5.3-RD]  13.26 29.51 90 top
D4  SS34BG  [SMB_L4.6-W3.6-LS5.3-RD]  25.58 29.31 90 top
D5  ST20100L  [TO-277_3P-L5.7-W4.2-LS6.5-BR]  16.1 42.42 0 top
D6  ST20100L  [TO-277_3P-L5.7-W4.2-LS6.5-BR]  28.55 42.39 0 top
D7  SS34BG  [SMB_L4.6-W3.6-LS5.3-RD]  45.82 29.44 90 top
D8  SS34BG  [SMB_L4.6-W3.6-LS5.3-RD]  58.04 29.36 90 top
D9  ST20100L  [TO-277_3P-L5.7-W4.2-LS6.5-BR]  60.96 43.51 0 top
D10  ST20100L  [TO-277_3P-L5.7-W4.2-LS6.5-BR]  48.75 43.65 0 top
P1  KF301-2P接线端子  [CONN-TH_XY301V-A-5.0-2P]  77.99 67.45 0 top
P2  KF301-2P接线端子  [CONN-TH_XY301V-A-5.0-2P]  21.77 68.63 0 top
P3  KF301-2P接线端子  [CONN-TH_XY301V-A-5.0-2P]  54.38 68.38 0 top
Q1  CSD19536KCS  [TO-220-3_L10.0-W4.5-P2.54-L]  15.82 36.44 0 top
Q2  CSD19536KCS  [TO-220-3_L10.0-W4.5-P2.54-L]  28.14 36.44 0 top
Q3  CSD19536KCS  [TO-220-3_L10.0-W4.5-P2.54-L]  48.36 36.84 0 top
Q4  CSD19536KCS  [TO-220-3_L10.0-W4.5-P2.54-L]  60.58 36.79 0 top
R1  20kΩ  [R0805]  25.62 6.15 180 top
R2  20kΩ  [R0805]  57.33 5.32 180 top
R3  2Ω  [R0805]  17.07 28.19 90 top
R4  2Ω  [R0805]  29.46 27.89 90 top
R5  10kΩ  [R0805]  18.06 31.95 180 top
R6  10kΩ  [R0805]  30.45 31.66 180 top
R7  2Ω  [R0805]  49.4 28.09 90 top
R8  2Ω  [R0805]  61.44 27.99 90 top
R9  10kΩ  [R0805]  50.42 31.8 180 top
R10  10kΩ  [R0805]  62.43 31.72 180 top
U1  UCC21520  [SOIC-16_L10.3-W7.5-P1.27-LS10.3-BL]  22.76 17.65 0 top
U2  UCC21520  [SOIC-16_L10.3-W7.5-P1.27-LS10.3-BL]  54.43 17.63 0 top
U3  860uH  [IND-TH_L29.0-W16.0-P14.00-D0.8]  21.74 54.69 180 top
U4  860uH  [IND-TH_L29.0-W16.0-P14.00-D0.8]  54.38 54.94 180 top

## Footprints (pads in the part's own frame, mm; a bottom-side part is the same pattern mirrored in y, then rotated)
C0805
  rect 1.41x1.35 smd: 1(-1,0) 2(1,0)
CAP-TH_BD16.0-P7.50-D1.2-FD
  round 2.2 hole 1.2: 1(-3.75,0) 2(3.75,0)
CAP-TH_L26.5-W10.0-P22.50-D1.4
  round 2.2 hole 1.4: 1(-11.249,0) 2(11.249,0)
CONN-TH_2P-P2.54-V
  rect 1.6x1.6 hole 1: 1(-1.27,0)
  round 1.6 hole 1: 2(1.27,0)
CONN-TH_XY301V-A-5.0-2P
  round 2 hole 1.2: 1(-2.5,0) 2(2.5,0)
IND-TH_L29.0-W16.0-P14.00-D0.8
  round 1.7 hole 1.1: 1(0,7) 2(0,-7)
R0805
  rect 1.133x1.377 smd: 1(-1,0) 2(1,0)
SMB_L4.6-W3.6-LS5.3-RD
  rect 2.047x2.192 smd: 1(-2.361,0) 2(2.361,0)
SMC_L7.1-W6.2-LS8.1-R-RD
  rect 3.03x3.82 smd: 1(3.435,0) 2(-3.435,0)
SOIC-16_L10.3-W7.5-P1.27-LS10.3-BL
  oval 0.574x2.401 smd: 1(-4.445,-4.75) 2(-3.175,-4.75) 3(-1.905,-4.75) 4(-0.635,-4.75) 5(0.635,-4.75) 6(1.905,-4.75) 7(3.175,-4.75) 8(4.445,-4.75) 9(4.445,4.75) 10(3.175,4.75) 11(1.905,4.75) 12(0.635,4.75) 13(-0.635,4.75) 14(-1.905,4.75) 15(-3.175,4.75) 16(-4.445,4.75)
TO-220-3_L10.0-W4.5-P2.54-L
  rect 1.8x2.6 hole 1.2: 1(-2.54,0.005)
  oval 1.8x2.6 hole 1.2: 2(0,0.005) 3(2.54,-0.005)
TO-277_3P-L5.7-W4.2-LS6.5-BR
  rect 1.29x1.423 smd: 1(1.933,-0.93) 3(1.933,0.93)
  rect 4.8x3.8 smd: 2(-1.933,0)

## Nets
As in the schematic.

Pads without a net: U1 7 12 13; U2 7 12 13

## Via types
v1: diameter 0.508, hole 0.254, Top Layer to Bottom Layer, 142 vias
v2: diameter 0.61, hole 0.305, Top Layer to Bottom Layer, 8 vias

## Routing (per net, layer and track width the routed paths; a pad name or vN(x,y) marks a point on that pad's centre or on a via; arc(x,y) is an arc through that point)
+5V: length 6.6
  Top Layer w0.574: v2(20.88,11.18) 20.85,11.2 U1.3 ; U2.8 v2(58.88,11.3) ; U1.8 v2(27.2,11.3) ; U2.3 v2(52.53,11.15)
+12V:
  vias: v1(24.07,20.59) v1(24.07,19.84) v1(24.1,18.95) v1(24.93,20.58) v1(24.93,19.84) v1(24.93,18.93) v1(55.93,19.73) v1(56.01,18.54) v1(56.26,20.37) v1(56.34,19.15) v1(56.63,19.73) v1(56.64,18.54)
DGND: length 20.2
  Top Layer w0.574: 53.79,8.91 53.79,11.6 53.8,11.61 ; 53.79,8.91 53.8,8.91 53.8,11.61 ; 53.79,8.91 v1(53.79,8.51) 54.35,8.51 55.07,9.23 U2.5 ; 53.8,11.61 U2.4 ; U1.5 23.39,10.03 22.77,9.4 v1(22.14,9.4) 22.12,9.42 U1.4
  vias: v1(26.66,8.44) v1(26.65,6.08) v1(58.37,7.86) v1(58.48,5.25)
PGND: length 35.1
  Top Layer w0.574: U2.9 58.88,23.7 59.92,24.74 61.95,24.74 63.43,26.22 R10.1 63.43,33.82 63.12,34.14 Q4.3 ; Q2.3 30.68,34.44 31.45,33.68 R6.1 31.45,25.81 30.35,24.71 27.94,24.71 27.2,23.98 27.2,22.4
  vias: v1(28.42,23.24) v1(28.41,22.43) v1(28.4,21.54) v1(28.37,20.85) v1(28.4,19.95) v1(29.34,20.85) v1(29.34,19.95) v1(29.39,23.22) v1(29.39,22.43) v1(29.39,21.54) v1(31.04,39.7) v1(31.04,38.56) v1(32.18,43.13) v1(32.18,41.99) v1(32.18,40.84) v1(32.18,39.7) v1(32.18,38.56) v1(32.18,37.41) v1(32.18,36.27) v1(33.32,43.13) v1(33.32,41.99) v1(33.32,40.84) v1(33.32,39.7) v1(33.32,38.56) v1(33.32,37.41) v1(33.32,36.27) v1(34.47,43.13) v1(34.47,41.99) v1(34.47,40.84) v1(34.47,39.7) v1(34.47,38.56) v1(34.47,37.41) v1(34.47,36.27) v1(35.61,43.13) v1(35.61,41.99) v1(35.61,40.84) v1(35.61,39.7) v1(35.61,38.56) v1(35.61,37.41) v1(35.61,36.27) v1(58.12,19.56) v1(58.24,20.43) v1(58.95,20.09) v1(59.6,20.6) v1(59.59,19.56) v1(63.38,40.92) v1(63.38,39.78) v1(63.38,38.63) v1(64.53,44.35) v1(64.53,43.2) v1(64.53,42.06) v1(64.53,40.92) v1(64.53,39.78) v1(64.53,38.63) v1(64.53,37.49) v1(64.53,36.35) v1(65.67,44.35) v1(65.67,43.2) v1(65.67,42.06) v1(65.67,40.92) v1(65.67,39.78) v1(65.67,38.63) v1(65.67,37.49) v1(65.67,36.35) v1(66.81,44.35) v1(66.81,43.2) v1(66.81,42.06) v1(66.81,40.92) v1(66.81,39.78) v1(66.81,38.63) v1(66.81,37.49) v1(66.81,36.35) v1(67.96,44.35) v1(67.96,43.2) v1(67.96,42.06) v1(67.96,40.92) v1(67.96,39.78) v1(67.96,38.63) v1(67.96,37.49) v1(67.96,36.35) v1(69.1,44.35) v1(69.1,43.2) v1(69.1,42.06) v1(69.1,40.92) v1(69.1,39.78) v1(69.1,38.63) v1(69.1,37.49) v1(69.1,36.35)
H1: length 9.6
  Top Layer w0.574: 17.03,27.15 R3.1 ; 17.03,27.15 17.03,26.53 19.58,23.98 19.58,22.4 ; 17.03,27.15 D3.1
H2: length 8.8
  Top Layer w0.574: U2.15 51.26,24.19 49.38,26.07 49.38,26.82 ; D7.1 49.39,27.08
L1: length 8.6
  Top Layer w0.574: R4.1 25.64,26.89 D4.1 25.58,24.71 25.93,24.36 25.93,22.4
L2: length 8.2
  Top Layer w0.574: U2.10 57.61,24.89 58.04,25.32 D8.1 61.43,27 R8.1
PWM1: length 6.9
  Top Layer w0.574: CN3.1 17.7,9.22 18.31,9.82 U1.1
PWM2: length 7
  Top Layer w0.574: U1.2 19.58,9.81 20.24,9.15 CN3.2
PWM3: length 7.5
  Top Layer w0.574: U2.1 49.99,9.6 49.5,9.12 CN4.1
PWM4: length 7.6
  Top Layer w0.574: CN4.2 52.04,8.84 51.26,9.63 U2.2
VS1: length 15.1
  Top Layer w0.574: 20.85,22.4 20.85,24.66 19.1,26.42 19.1,31.91 R5.1 19.06,34.1 18.36,34.8 Q1.3
  vias: v2(20.55,20.75) v2(21.18,20.75) v2(21.82,20.12) v2(21.82,19.48)
VS2: length 15.1
  Top Layer w0.574: U2.14 52.53,25.02 51.42,26.13 R9.1 51.42,33.72 50.9,34.24 Q3.3
  vias: v1(51.9,19.74) v1(52.46,20.69) v1(52.76,19.74) v1(53.47,19.71)
$1N1918: length 11.4
  Top Layer w0.574: R4.2 29.46,31.64 R6.2 29.43,31.67 D4.2 25.58,36.42 Q2.1
$1N1920: length 11.2
  Top Layer w0.574: R5.2 17.06,29.2 R3.2 ; 17.06,31.95 13.34,31.95 13.26,31.88 13.26,36.42 Q1.1
$1N1922: length 11.4
  Top Layer w0.574: R7.2 49.4,31.78 49.42,31.8 D7.2 Q3.1
$1N1924: length 11.2
  Top Layer w0.574: 61.43,31.72 D8.2 Q4.1 ; R10.2 61.43,29 R8.2
$1N1931: length 7.6
  Top Layer w0.574: R2.2 56.33,7.88 C3.2 56.32,12.86 U2.6
$1N1939: length 6.8
  Top Layer w0.574: U1.6 24.67,12.9 C1.2 24.67,6.2 R1.2
$1N1949:
  vias: v1(44.5,21.32) v1(44.5,20.31) v1(45.52,21.32) v1(45.52,20.31) v1(46.53,21.32) v1(46.53,20.31) v1(47.55,24.37) v1(47.55,23.36) v1(47.55,22.34) v1(47.55,21.32) v1(47.55,20.31) v1(48.56,24.37) v1(48.56,23.36) v1(48.56,22.34) v1(48.56,21.32) v1(48.56,20.31)
$1N1950:
  vias: v1(12.98,21.2) v1(12.98,20.18) v1(14,21.2) v1(14,20.18) v1(15.01,21.2) v1(15.01,20.18) v1(16.03,24.24) v1(16.03,23.23) v1(16.03,22.21) v1(16.03,21.2) v1(16.03,20.18) v1(17.04,24.24) v1(17.04,23.23) v1(17.04,22.21) v1(17.04,21.2) v1(17.04,20.18)

## Copper pours and planes (outline as drawn; the poured copper is in the pictures)
+5V on Bottom Layer: 3.51,10.62 60.43,10.62 60.43,14.48 3.49,14.48 3.49,10.64
+12V on Top Layer: 55.78,23.93 56.95,23.93 56.95,21.06 57.38,20.62 57.38,17.65 55.12,17.65 55.12,20.32 55.77,20.97 55.77,23.92
+12V on Top Layer: 24.05,23.85 25.22,23.85 25.22,20.95 25.78,20.4 25.78,18.47 23.22,18.47 23.22,20.2 24.04,21.02 24.04,23.84
+12V on Bottom Layer: 57.38,20.75 57.38,18.64 70.09,18.64 70.09,15.34 54.34,15.34 54.34,15.37 11.88,15.37 11.88,18.47 23.22,18.47 23.22,20.19 24.07,21.05 24.07,23.93 25.22,23.93 25.25,23.9 25.25,21.17 25.73,20.69 25.73,18.63 54.34,18.63 54.34,18.64 55.14,18.64 55.14,20.35 55.7,20.91 55.76,24 57.07,24 57.07,21.06
+VIN on Top Layer: 78.12,71.05 78.12,58.35 89.37,58.35 89.37,20.9 81.69,20.9 81.69,49.91 49.38,49.91 49.38,35.36 47.4,35.36 47.4,38.68 43.43,38.68 43.43,49.73 16.76,49.73 16.76,34.87 14.58,34.87 14.58,38.86 14.61,38.89 11.58,38.89 11.56,38.91 11.56,58.12 71.92,58.12 71.92,71.05
DGND on Bottom Layer: 3.58,9.93 60.43,9.93 60.43,3.5 3.58,3.5
PGND on Top Layer: 26.27,18.62 30.47,18.62 30.47,23.95 26.68,23.95 26.68,21.31 26.27,20.9
PGND on Top Layer: 29.64,44.6 36.32,44.6 36.32,34.87 29.64,34.87
PGND on Top Layer: 57.86,18.82 60.2,18.82 60.2,20.72 59.56,21.36 59.56,23.98 58.32,23.98 58.32,21.34 57.86,20.88
PGND on Top Layer: 61.98,45.64 69.7,45.64 69.7,34.95 61.98,34.95
PGND on Bottom Layer: 83.74,19.15 62,19.15 62,39.45 36.35,39.45 36.35,34.93 36.34,34.92 29.79,34.92 29.72,35 29.72,46.48 77.17,46.48 77.17,69.75 83.74,69.75
PGND on Bottom Layer: 57.76,19.2 60.3,19.2 60.3,20.55 59.59,21.26 59.59,24 58.22,24 58.22,21.06 57.76,20.6
PGND on Bottom Layer: 26.24,19.18 30.56,19.18 30.56,24.03 26.7,24.03 26.7,21.08 26.24,20.62
BRIDGE1 on Top Layer: 17.17,70.05 26.26,70.05 26.26,59.97 17.17,59.97
BRIDGE2 on Top Layer: 50.09,70.33 58.47,70.33 58.47,59.92 50.09,59.92
VS1 on Top Layer: 19.86,18.69 22.33,18.69 22.33,20.42 21.51,21.23 21.51,23.85 20.27,23.85 20.27,21.36 19.86,20.95
VS1 on Top Layer: 17.4,34.92 17.4,49.07 29.06,49.07 29.06,34.73 27.14,34.73 27.08,34.67 27.08,38.37 24.1,38.37 24.1,34.92
VS1 on Bottom Layer: 19.81,19.05 22.36,19.05 22.36,20.39 21.64,21.11 21.64,23.85 20.27,23.85 20.27,21.36 19.81,20.9
VS2 on Top Layer: 51.41,18.95 54.05,18.95 54.05,20.09 52.81,21.34 52.81,23.98 52.25,23.98 52.25,21.34 51.41,20.5
VS2 on Top Layer: 50.04,35.18 50.04,49.33 61.49,49.33 61.49,35.37 59.64,35.37 59.64,38.78 56.61,38.78 56.61,35.18
VS2 on Bottom Layer: 51.54,19.13 54.16,19.13 54.16,20.01 53.24,20.93 53.24,24 51.87,24 51.87,21.16 51.54,20.83
$1N1949 on Top Layer: 43.23,25.44 43.23,19.04 51.14,19.04 51.14,20.71 50.34,21.5 50.34,23.74 48.64,25.44
$1N1949 on Bottom Layer: 43.18,25.5 43.18,19.1 51.09,19.1 51.09,20.77 50.6,21.26 50.6,23.49 48.59,25.5
$1N1950 on Top Layer: 11.71,25.31 11.71,18.91 18.82,18.91 18.82,23.61 17.12,25.31
$1N1950 on Bottom Layer: 11.68,25.42 11.68,19.08 19.41,19.08 19.41,20.72 18.9,21.23 18.9,23.65 17.12,25.42

## Text on the board
Top Silkscreen Layer: PWM1 | PWM2 | PWM3 | PWM4 | VS1 | VS2 | VDC | GND | 5V | 12V

# Board 单相_贴片
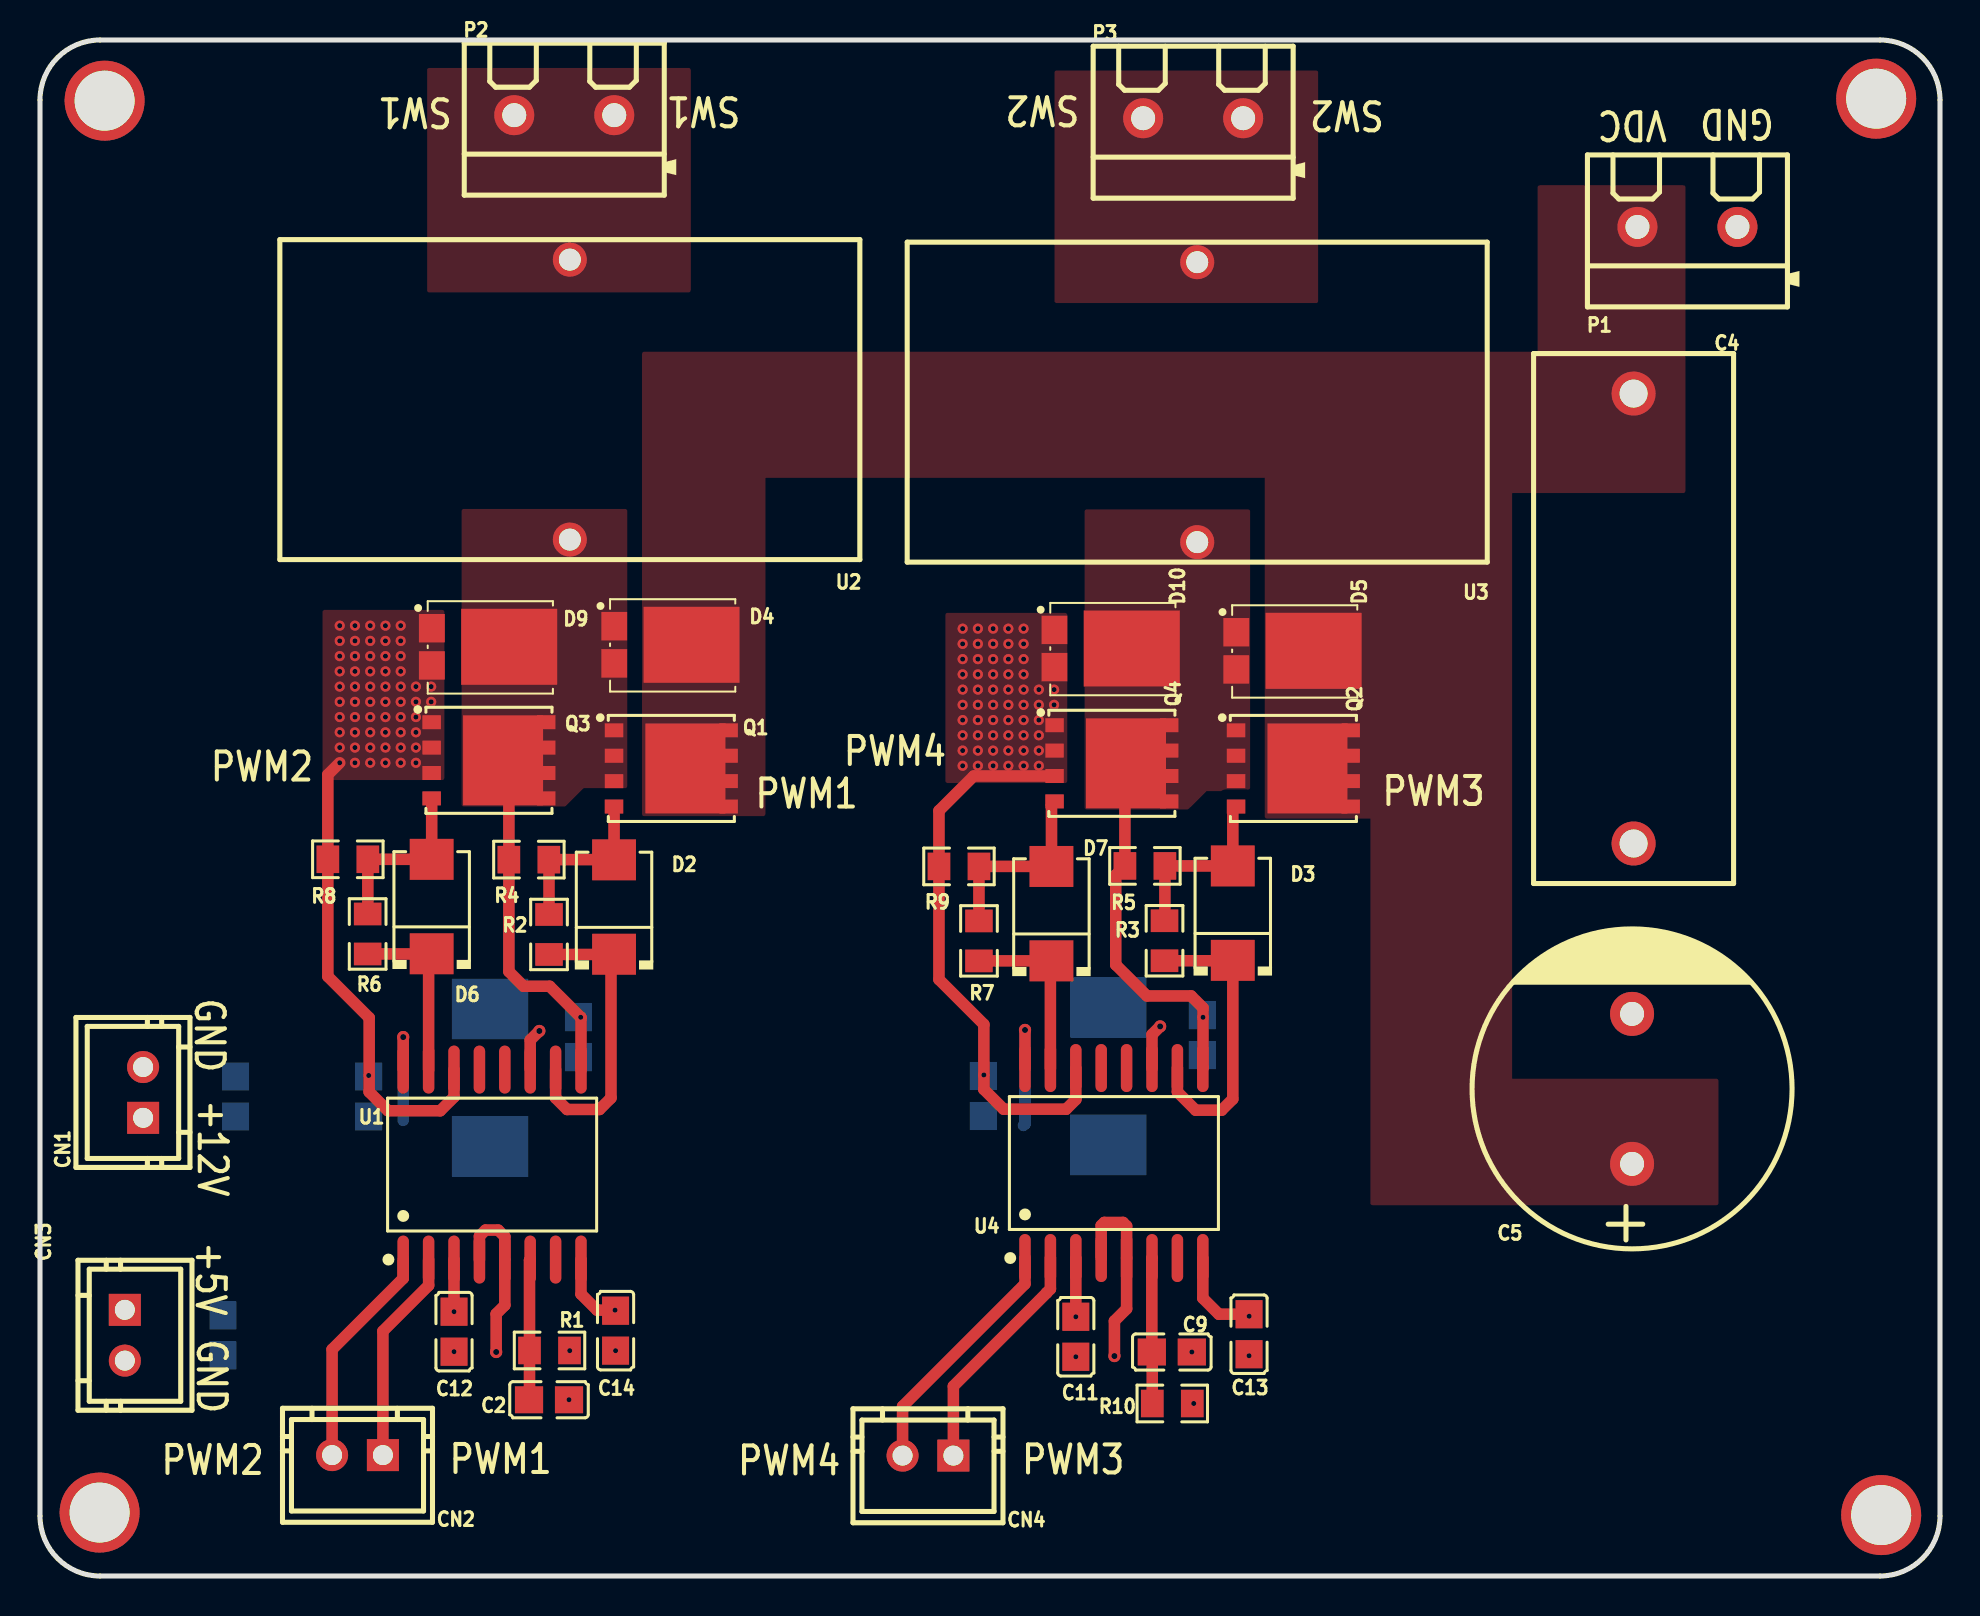
[diagram p5: board, top side]
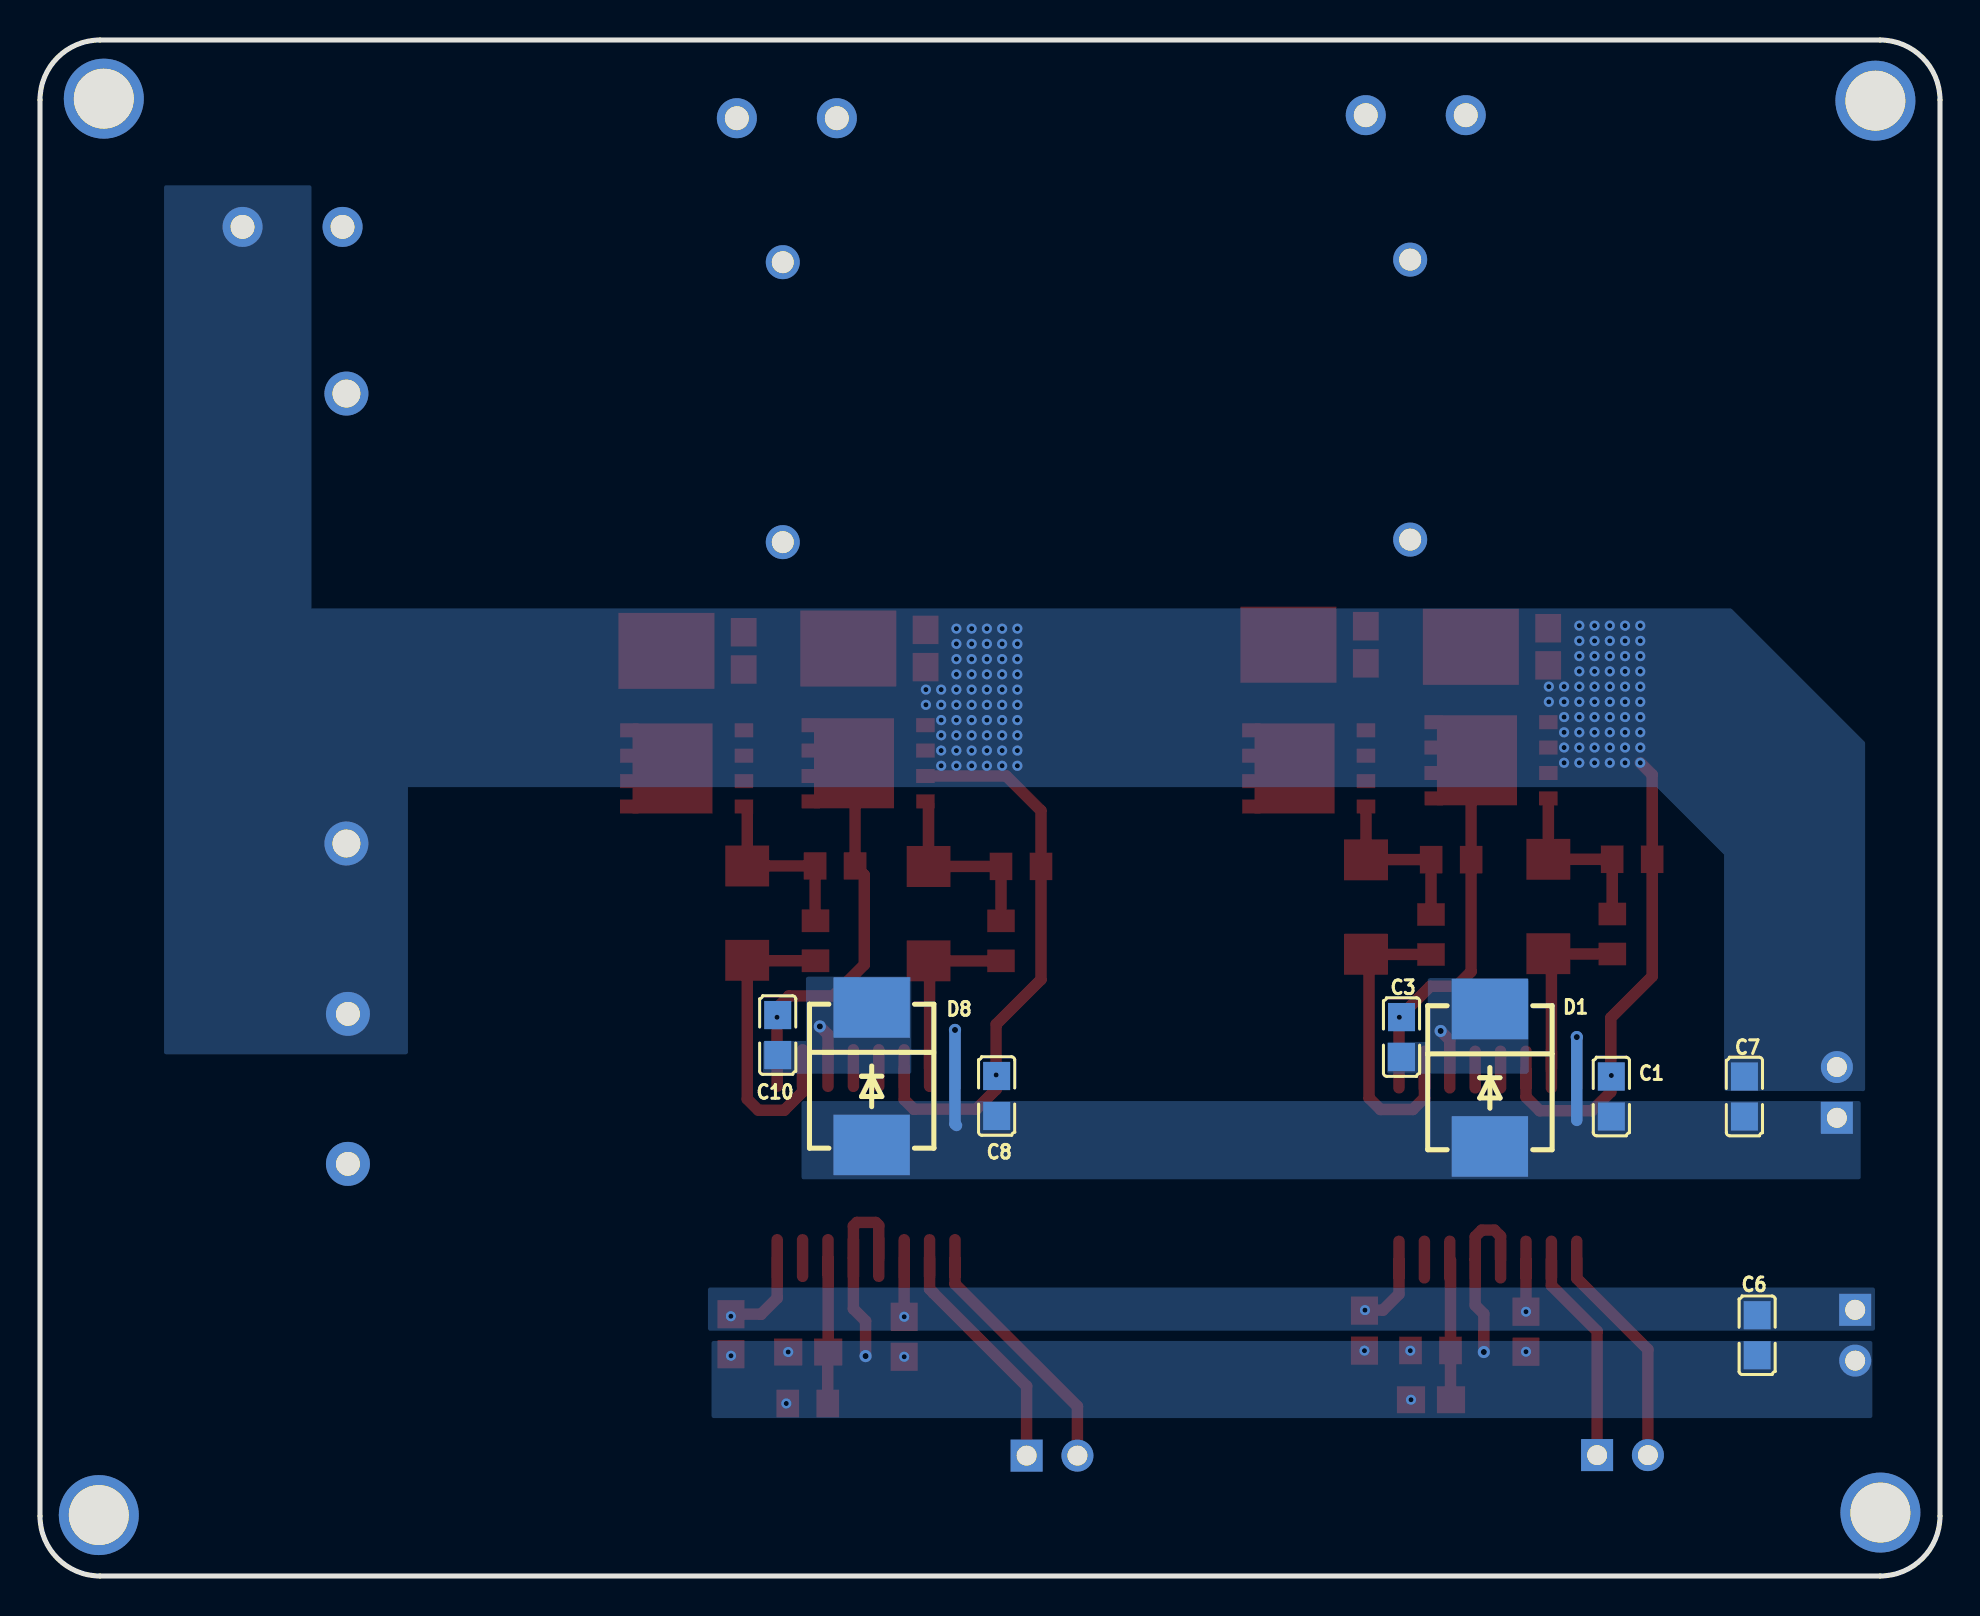
[diagram p6: board, bottom side, seen from below]

Outline 95 x 76.81 mm; copper layers: Top Layer, Bottom Layer. Coordinates in mm from the lower left corner of the outline.
Outline path: 0,73.81 0,3 arc(0.88,0.88) 3,0 92,0 arc(94.12,0.88) 95,3 95,73.81 arc(94.12,75.93) 92,76.81 3,76.81 arc(0.88,75.93) 0,73.81
Stack: Top Layer 0.035mm / Dielectric1 1.51mm FR4 er 4.5 / Bottom Layer 0.035mm

## Design rules (mm)
template: 自定义配置
spacing copperThickness1oz (default): track to track 0.508, other pairs 0.508 to 0.508
spacing copperThickness2oz: track to track 0.203, other pairs 0.152 to 0.3
track width copperThickness1oz (default): min 0.127, default 0.254, max 2.54
track width copperThickness2oz: min 0.203, default 0.254, max 2.54
differential pair differentialPair (default): width min 0.127, default 0.254, max 2.54; gap min 0.152, default 0.152
via viaSize (default): diameter min 0.5, default 0.508, max 10; hole min 0.127, default 0.254, max 6.3

## Placement (name value [footprint] x y rotation side)
C1  1uF  [C0805]  16.43 23.98 270 bottom
C2  100nF  [C0805]  25.45 8.81 180 top
C3  1uF  [C0805]  26.92 26.95 270 bottom
C4  1uF  [CAP-TH_L26.5-W10.0-P22.50-D1.4]  79.68 47.88 270 top
C5  470uF  [CAP-TH_BD16.0-P7.50-D1.2-FD]  79.6 24.36 90 top
C6  100nF  [C0805]  9.14 12.04 90 bottom
C7  100nF  [C0805]  9.78 23.98 270 bottom
C8  1uF  [C0805]  47.17 24 270 bottom
C9  100nF  [C0805]  56.59 11.2 180 top
C10  1uF  [C0805]  58.12 27.05 270 bottom
C11  100nF  [C0805]  51.79 11.96 90 top
C12  100nF  [C0805]  20.7 12.22 90 top
C13  100nF  [C0805]  60.45 12.09 90 top
C14  100nF  [C0805]  28.78 12.27 90 top
CN1  CON2-2.54*2P  [CONN-TH_2P-P2.54-V]  5.16 24.18 90 top
CN2  CON2-2.54*2P  [CONN-TH_2P-P2.54-V]  15.88 6.05 180 top
CN3  CON2-2.54*2P  [CONN-TH_2P-P2.54-V]  4.24 12.04 270 top
CN4  CON2-2.54*2P  [CONN-TH_2P-P2.54-V]  44.4 6.02 180 top
D1  RS3MC  [SMC_L7.1-W6.2-LS8.1-R-RD]  22.5 24.92 270 bottom
D2  SS34BG  [SMB_L4.6-W3.6-LS5.3-RD]  28.7 33.45 90 top
D3  SS34BG  [SMB_L4.6-W3.6-LS5.3-RD]  59.64 33.15 90 top
D4  ST20100L  [TO-277_3P-L5.7-W4.2-LS6.5-BR]  30.64 46.57 180 top
D5  ST20100L  [TO-277_3P-L5.7-W4.2-LS6.5-BR]  61.75 46.26 180 top
D6  SS34BG  [SMB_L4.6-W3.6-LS5.3-RD]  19.58 33.48 90 top
D7  SS34BG  [SMB_L4.6-W3.6-LS5.3-RD]  50.57 33.12 90 top
D8  RS3MC  [SMC_L7.1-W6.2-LS8.1-R-RD]  53.42 24.99 270 bottom
D9  ST20100L  [TO-277_3P-L5.7-W4.2-LS6.5-BR]  21.53 46.47 180 top
D10  ST20100L  [TO-277_3P-L5.7-W4.2-LS6.5-BR]  52.65 46.38 180 top
NOREF  -  [Pad_e50]  2.98 3.17 0 top
NOREF#2  -  [Pad_e48]  3.23 73.78 0 top
NOREF#3  -  [Pad_e52]  91.81 73.88 0 top
NOREF#4  -  [Pad_e51]  92.06 3.05 0 top
P1  KF301-2P接线端子  [CONN-TH_XY301V-A-5.0-2P]  82.37 67.46 0 top
P2  KF301-2P接线端子  [CONN-TH_XY301V-A-5.0-2P]  26.21 73.05 0 top
P3  KF301-2P接线端子  [CONN-TH_XY301V-A-5.0-2P]  57.66 72.9 0 top
Q1  BSC0805LS  [PG-TDSON-8_L5.2-W5.9-P1.27-LS6.2-BL-EP]  31.57 40.38 270 top
Q2  BSC0805LS  [PG-TDSON-8_L5.2-W5.9-P1.27-LS6.2-BL-EP]  62.67 40.38 270 top
Q3  BSC0805LS  [PG-TDSON-8_L5.2-W5.9-P1.27-LS6.2-BL-EP]  22.45 40.79 270 top
Q4  BSC0805LS  [PG-TDSON-8_L5.2-W5.9-P1.27-LS6.2-BL-EP]  53.59 40.64 270 top
R1  20kΩ  [R0805]  25.48 11.28 180 top
R2  2Ω  [R0805]  25.45 32.08 90 top
R3  2Ω  [R0805]  56.23 31.77 90 top
R4  10kΩ  [R0805]  24.44 35.82 0 top
R5  10kΩ  [R0805]  55.25 35.51 0 top
R6  2Ω  [R0805]  16.38 32.11 90 top
R7  2Ω  [R0805]  46.95 31.76 90 top
R8  10kΩ  [R0805]  15.39 35.84 0 top
R9  10kΩ  [R0805]  45.95 35.48 0 top
R10  20kΩ  [R0805]  56.61 8.63 180 top
U1  UCC21520  [SOIC-16_L10.3-W7.5-P1.27-LS10.3-BL]  22.61 20.57 0 top
U2  860uH  [IND-TH_L29.0-W16.0-P14.00-D0.8]  26.49 58.83 180 top
U3  860uH  [IND-TH_L29.0-W16.0-P14.00-D0.8]  57.86 58.7 180 top
U4  UCC21520  [SOIC-16_L10.3-W7.5-P1.27-LS10.3-BL]  53.7 20.65 0 top

## Footprints (pads in the part's own frame, mm; a bottom-side part is the same pattern mirrored in y, then rotated)
C0805
  rect 1.41x1.35 smd: 1(-1,0) 2(1,0)
CAP-TH_BD16.0-P7.50-D1.2-FD
  round 2.2 hole 1.2: 1(-3.75,0) 2(3.75,0)
CAP-TH_L26.5-W10.0-P22.50-D1.4
  round 2.2 hole 1.4: 1(-11.249,0) 2(11.249,0)
CONN-TH_2P-P2.54-V
  rect 1.6x1.6 hole 1: 1(-1.27,0)
  round 1.6 hole 1: 2(1.27,0)
CONN-TH_XY301V-A-5.0-2P
  round 2 hole 1.2: 1(-2.5,0) 2(2.5,0)
IND-TH_L29.0-W16.0-P14.00-D0.8
  round 1.7 hole 1.1: 1(0,7) 2(0,-7)
Pad_e48
  round 4 hole 3: 1(0,0)
Pad_e50
  round 4 hole 3: 1(0,0)
Pad_e51
  round 4 hole 3: 1(0,0)
Pad_e52
  round 4 hole 3: 1(0,0)
PG-TDSON-8_L5.2-W5.9-P1.27-LS6.2-BL-EP
  rect 0.7x0.925 smd: 1(-1.905,-2.865) 2(-0.635,-2.865) 3(0.635,-2.865) 4(1.905,-2.865) 5(1.905,2.865) 6(0.635,2.865) 7(-0.635,2.865) 8(-1.905,2.865)
  rect 4.5x4 smd: 9(0.001,0.705)
R0805
  rect 1.133x1.377 smd: 1(-1,0) 2(1,0)
SMB_L4.6-W3.6-LS5.3-RD
  rect 2.047x2.192 smd: 1(-2.361,0) 2(2.361,0)
SMC_L7.1-W6.2-LS8.1-R-RD
  rect 3.03x3.82 smd: 1(3.435,0) 2(-3.435,0)
SOIC-16_L10.3-W7.5-P1.27-LS10.3-BL
  oval 0.574x2.401 smd: 1(-4.445,-4.75) 2(-3.175,-4.75) 3(-1.905,-4.75) 4(-0.635,-4.75) 5(0.635,-4.75) 6(1.905,-4.75) 7(3.175,-4.75) 8(4.445,-4.75) 9(4.445,4.75) 10(3.175,4.75) 11(1.905,4.75) 12(0.635,4.75) 13(-0.635,4.75) 14(-1.905,4.75) 15(-3.175,4.75) 16(-4.445,4.75)
TO-277_3P-L5.7-W4.2-LS6.5-BR
  rect 1.29x1.423 smd: 1(1.933,-0.93) 3(1.933,0.93)
  rect 4.8x3.8 smd: 2(-1.933,0)

## Nets
As in the schematic.

Pads without a net: NOREF 1; NOREF#2 1; NOREF#3 1; NOREF#4 1; U1 7 12 13; U4 7 12 13

## Via types
v1: diameter 0.508, hole 0.254, Top Layer to Bottom Layer, 132 vias
v2: diameter 0.61, hole 0.305, Top Layer to Bottom Layer, 6 vias

## Routing (per net, layer and track width the routed paths; a pad name or vN(x,y) marks a point on that pad's centre or on a via; arc(x,y) is an arc through that point)
+5V: length 14
  Top Layer w0.574: v1(51.79,12.96) U4.3 ; C13.2 58.94,13.09 58.14,13.89 U4.8 ; v1(20.7,13.22) U1.3 ; U1.8 27.05,14.1 27.85,13.3 v1(28.75,13.3)
  vias: v1(60.46,12.99)
+12V: length 12.5
  Top Layer w0.574: U1.16 v2(18.16,26.95) ; 49.25,25.4 v2(49.25,27.31)
  Bottom Layer w0.574: v2(49.25,27.31) 49.25,22.61 49.17,22.53 ; v2(18.16,26.95) 18.16,22.78
DGND: length 18.4
  Top Layer w0.574: v2(22.81,11.2) 22.81,13.11 23.24,13.54 U1.5 23.24,16.97 22.91,17.3 22.28,17.3 21.97,16.99 U1.4 ; v1(26.49,11.27) R1.1 ; U4.4 53.06,17.53 53.21,17.68 54.15,17.68 54.33,17.5 U4.5 54.33,13.36 53.72,12.75 v2(53.72,11)
  vias: v1(20.7,11.22) v1(26.45,8.81) v1(28.78,11.27) v1(51.79,10.96) v1(57.59,11.2) v1(57.69,8.63) v1(60.45,11.01)
PGND: length 52
  Top Layer w0.574: U1.14 20.7,23.95 20.02,23.27 17.4,23.27 16.46,24.21 16.46,27.91 14.39,29.98 R8.1 14.39,40.07 v1(14.99,40.67) ; 51.79,25.4 51.79,23.83 51.31,23.34 48.18,23.34 47.19,24.33 v1(47.19,25.06) 47.19,27.58 44.95,29.83 R9.1 44.95,38.27 46.69,40 Q4.3
  vias: v1(14.99,47.52) v1(14.99,46.76) v1(14.99,46) v1(14.99,45.24) v1(14.99,44.48) v1(14.99,43.71) v1(14.99,42.95) v1(14.99,42.19) v1(14.99,41.43) v1(15.75,47.52) v1(15.75,46.76) v1(15.75,46) v1(15.75,45.24) v1(15.75,44.48) v1(15.75,43.71) v1(15.75,42.95) v1(15.75,42.19) v1(15.75,41.43) v1(15.75,40.67) v1(16.43,25.03) v1(16.51,47.52) v1(16.51,46.76) v1(16.51,46) v1(16.51,45.24) v1(16.51,44.48) v1(16.51,43.71) v1(16.51,42.95) v1(16.51,42.19) v1(16.51,41.43) v1(16.51,40.67) v1(17.27,47.52) v1(17.27,46.76) v1(17.27,46) v1(17.27,45.24) v1(17.27,44.48) v1(17.27,43.71) v1(17.27,42.95) v1(17.27,42.19) v1(17.27,41.43) v1(17.27,40.67) v1(18.03,47.52) v1(18.03,46.76) v1(18.03,46) v1(18.03,45.24) v1(18.03,44.48) v1(18.03,43.71) v1(18.03,42.95) v1(18.03,42.19) v1(18.03,41.43) v1(18.03,40.67) v1(18.8,44.48) v1(18.8,43.71) v1(18.8,42.95) v1(18.8,42.19) v1(18.8,41.43) v1(18.8,40.67) v1(19.56,44.48) v1(19.56,43.71) v1(46.13,47.37) v1(46.13,46.61) v1(46.13,45.85) v1(46.13,45.09) v1(46.13,44.33) v1(46.13,43.56) v1(46.13,42.8) v1(46.13,42.04) v1(46.13,41.28) v1(46.13,40.52) v1(46.89,47.37) v1(46.89,46.61) v1(46.89,45.85) v1(46.89,45.09) v1(46.89,44.33) v1(46.89,43.56) v1(46.89,42.8) v1(46.89,42.04) v1(46.89,41.28) v1(46.89,40.52) v1(47.66,47.37) v1(47.66,46.61) v1(47.66,45.85) v1(47.66,45.09) v1(47.66,44.33) v1(47.66,43.56) v1(47.66,42.8) v1(47.66,42.04) v1(47.66,41.28) v1(47.66,40.52) v1(48.42,47.37) v1(48.42,46.61) v1(48.42,45.85) v1(48.42,45.09) v1(48.42,44.33) v1(48.42,43.56) v1(48.42,42.8) v1(48.42,42.04) v1(48.42,41.28) v1(48.42,40.52) v1(49.18,47.37) v1(49.18,46.61) v1(49.18,45.85) v1(49.18,45.09) v1(49.18,44.33) v1(49.18,43.56) v1(49.18,42.8) v1(49.18,42.04) v1(49.18,41.28) v1(49.18,40.52) v1(49.94,44.33) v1(49.94,43.56) v1(49.94,42.8) v1(49.94,42.04) v1(49.94,41.28) v1(49.94,40.52) v1(50.7,44.33) v1(50.7,43.56)
H1: length 15.2
  Top Layer w0.574: D2.1 28.69,31.08 ; 28.69,31.08 28.55,30.94 28.55,23.9 27.98,23.33 26.35,23.33 25.78,23.9 U1.10 ; 28.69,31.08 R2.1
H2: length 14.9
  Top Layer w0.574: 56.87,25.4 56.87,24.21 57.78,23.29 59.08,23.29 59.64,23.85 D3.1 59.62,30.77 R3.1
L1: length 9
  Top Layer w0.574: R6.1 19.29,31.11 19.43,30.96 ; 19.43,30.96 19.58,31.12 ; 19.43,30.96 U1.15
L2: length 9
  Top Layer w0.574: 50.52,25.4 50.52,30.71 50.57,30.76 R7.1
PWM1: length 10.7
  Top Layer w0.574: U1.2 19.43,14.53 17.14,12.24 CN2.1
PWM2: length 11.3
  Top Layer w0.574: U1.1 18.16,14.88 14.61,11.33 CN2.2
PWM3: length 11.9
  Top Layer w0.574: CN4.1 45.67,9.49 50.33,14.16 50.33,14.16 50.52,14.35 U4.2
PWM4: length 12.4
  Top Layer w0.574: U4.1 49.25,14.61 43.13,8.48 CN4.2
VS1: length 17.8
  Top Layer w0.574: U1.9 27.05,27.92 v1(27.03,27.94) 25.49,29.49 24.18,29.49 23.44,30.23 R4.1 23.44,40.5 Q3.9
VS2: length 18.6
  Top Layer w0.574: 58.14,25.4 58.15,25.41 v1(58.15,27.94) 58.15,28.41 57.56,29.01 55.35,29.01 53.79,30.57 53.79,35.05 R5.1 54.25,40.59 Q4.9
$1N2033: length 9
  Top Layer w0.574: 19.58,38.88 D6.2 ; 19.58,35.84 R8.2 16.39,33.11 R6.2
$1N2035: length 8.7
  Top Layer w0.574: 28.7,38.48 D2.2 28.69,35.82 R4.2 25.45,35.82 R2.2
$1N2037: length 9.2
  Top Layer w0.574: D3.2 59.64,38.31 Q2.4 ; R3.2 56.25,32.78 R5.2 59.64,35.51
$1N2039: length 9.7
  Top Layer w0.574: R7.2 R9.2 50.57,35.48 50.58,35.49 50.58,38.58 Q4.4
$1N2046: length 7.3
  Top Layer w0.574: R10.2 55.61,11.18 C9.2 55.59,15.89 U4.6
$1N2049: length 2.1
  Top Layer w0.574: v2(24.97,27.25) 24.51,26.8 U1.11
$1N2054: length 7
  Top Layer w0.574: C2.2 24.48,8.84 R1.2 24.48,15.79 U1.6
$1N4233: length 2.3
  Top Layer w0.574: 55.6,25.4 55.6,27.08 v2(56.01,27.48)

## Copper pours and planes (outline as drawn; the poured copper is in the pictures)
+5V on Bottom Layer: 3.25,14.43 61.6,14.43 61.6,12.27 3.25,12.27
+12V on Bottom Layer: 3.99,23.75 56.9,23.75 56.92,23.72 56.92,19.84 3.96,19.84 3.96,23.72
+VIN on Top Layer: 74.88,69.55 74.88,61.21 30.1,61.21 30.1,38 36.27,38 36.27,54.92 61.24,54.92 61.24,37.87 66.52,37.87 66.52,18.57 66.55,18.54 83.9,18.54 83.92,18.57 83.92,24.87 73.61,24.87 73.61,54.15 82.27,54.15 82.27,69.55
DGND on Bottom Layer: 3.38,11.84 61.42,11.84 61.42,7.9 3.38,7.9
PGND on Top Layer: 14.12,48.31 20.22,48.31 20.22,39.8 14.12,39.8
PGND on Top Layer: 45.27,48.16 51.36,48.16 51.36,39.65 45.27,39.65
PGND on Bottom Layer: 10.44,48.39 81.43,48.39 81.43,69.55 88.8,69.55 88.8,26.09 76.61,26.09 76.61,39.45 14.17,39.45 10.8,36.07 10.8,24.23 3.74,24.23 3.74,41.69
BRIDGE1 on Top Layer: 19.35,75.41 32.54,75.41 32.54,64.19 19.35,64.19
BRIDGE2 on Top Layer: 50.72,75.29 63.91,75.29 63.91,63.65 50.72,63.65
VS1 on Top Layer: 21.08,38.48 26.26,38.48 27.18,39.4 29.36,39.4 29.36,53.36 21.08,53.36
VS2 on Top Layer: 52.23,38.33 57.41,38.33 58.33,39.25 60.51,39.25 60.51,53.34 52.23,53.34
$1N2049 on Bottom Layer: 20.57,29.9 25.61,29.9 25.61,26.71 27.65,26.71 27.65,25.12 20.57,25.12
$1N4233 on Bottom Layer: 51.44,29.97 56.7,29.97 56.7,26.76 58.84,26.76 58.84,25.12 51.44,25.12

## Text on the board
Top Silkscreen Layer: PWM2 | PWM1 | PWM4 | PWM3 | SW1 | SW2 | VDC | GND | +5V | +12V

# Board 单相_GaN
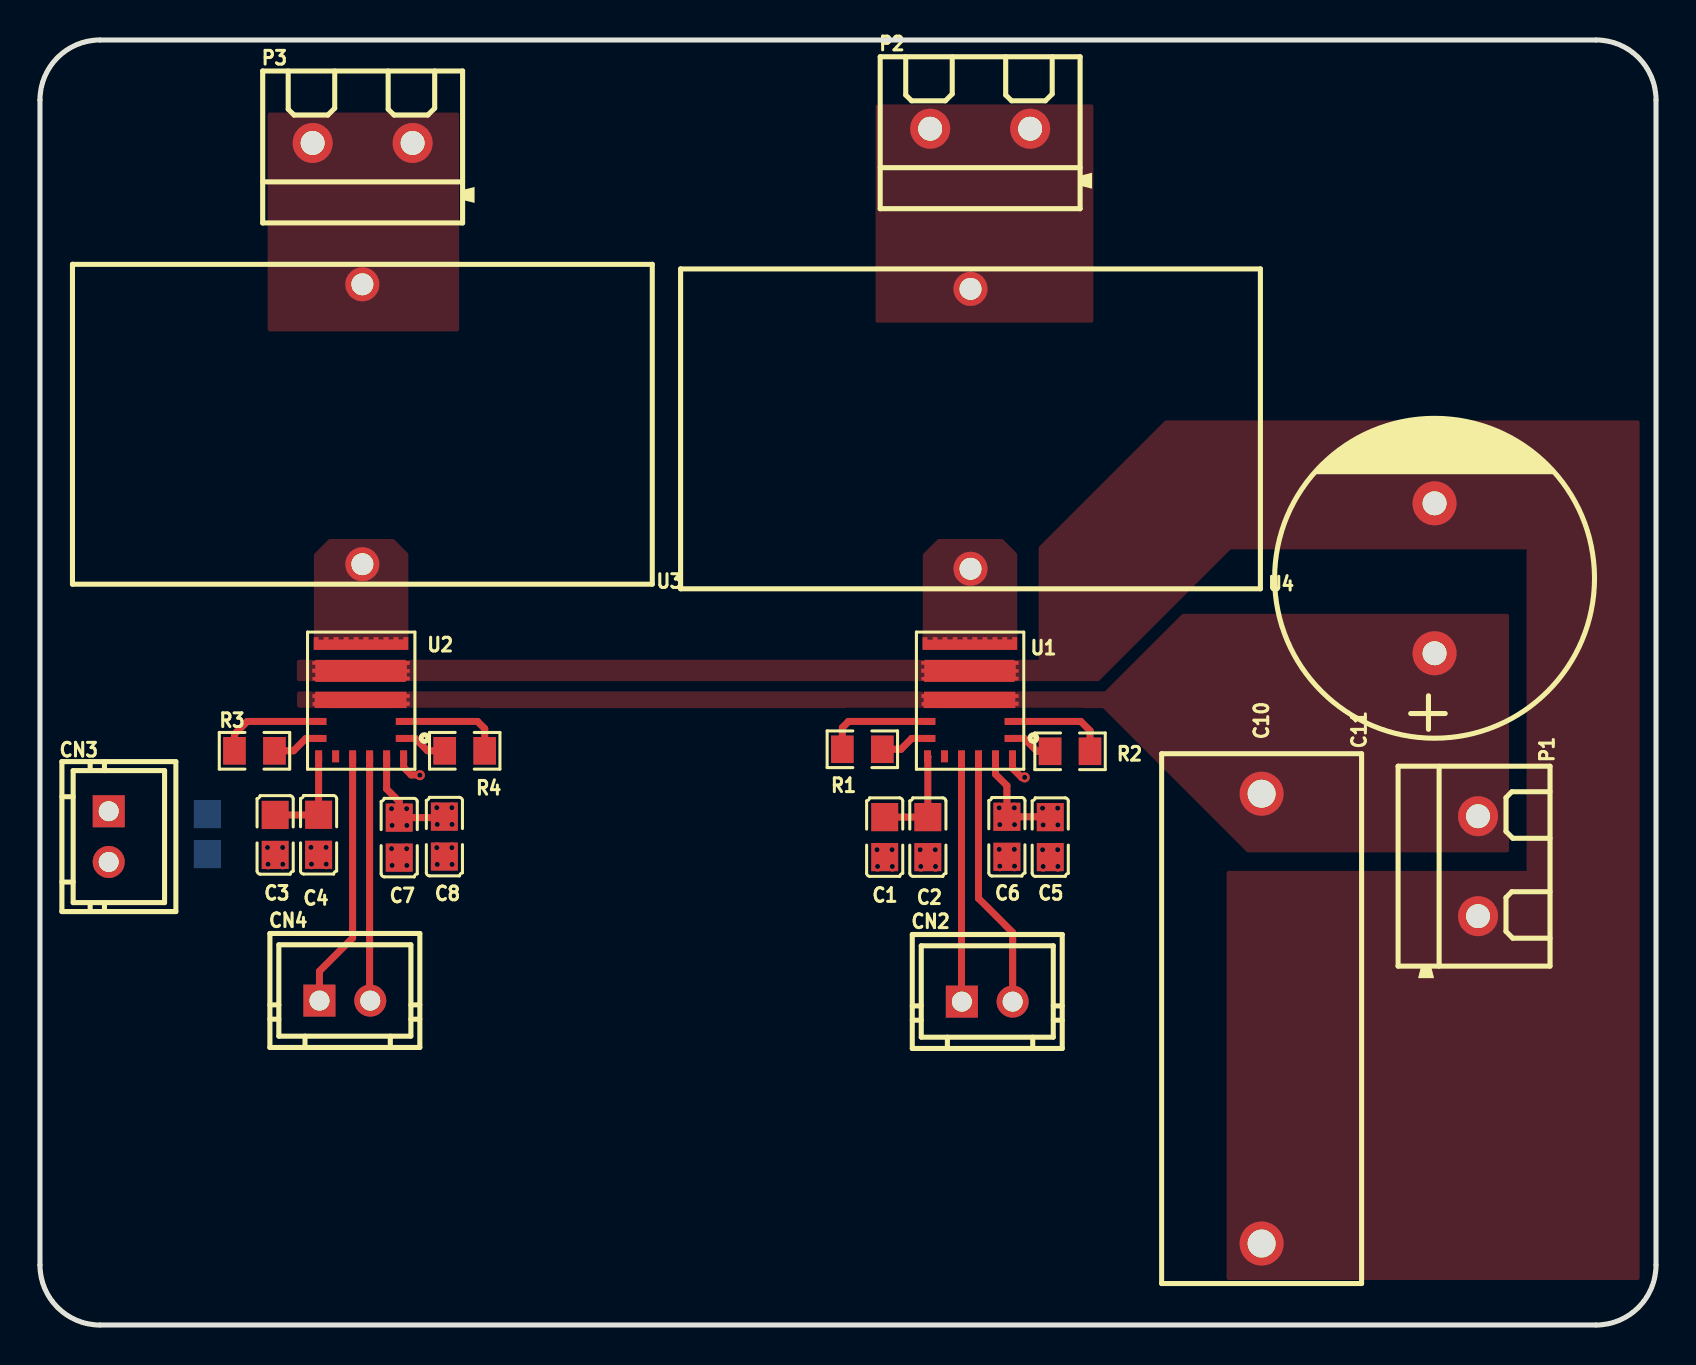
[diagram p7: board, top side]
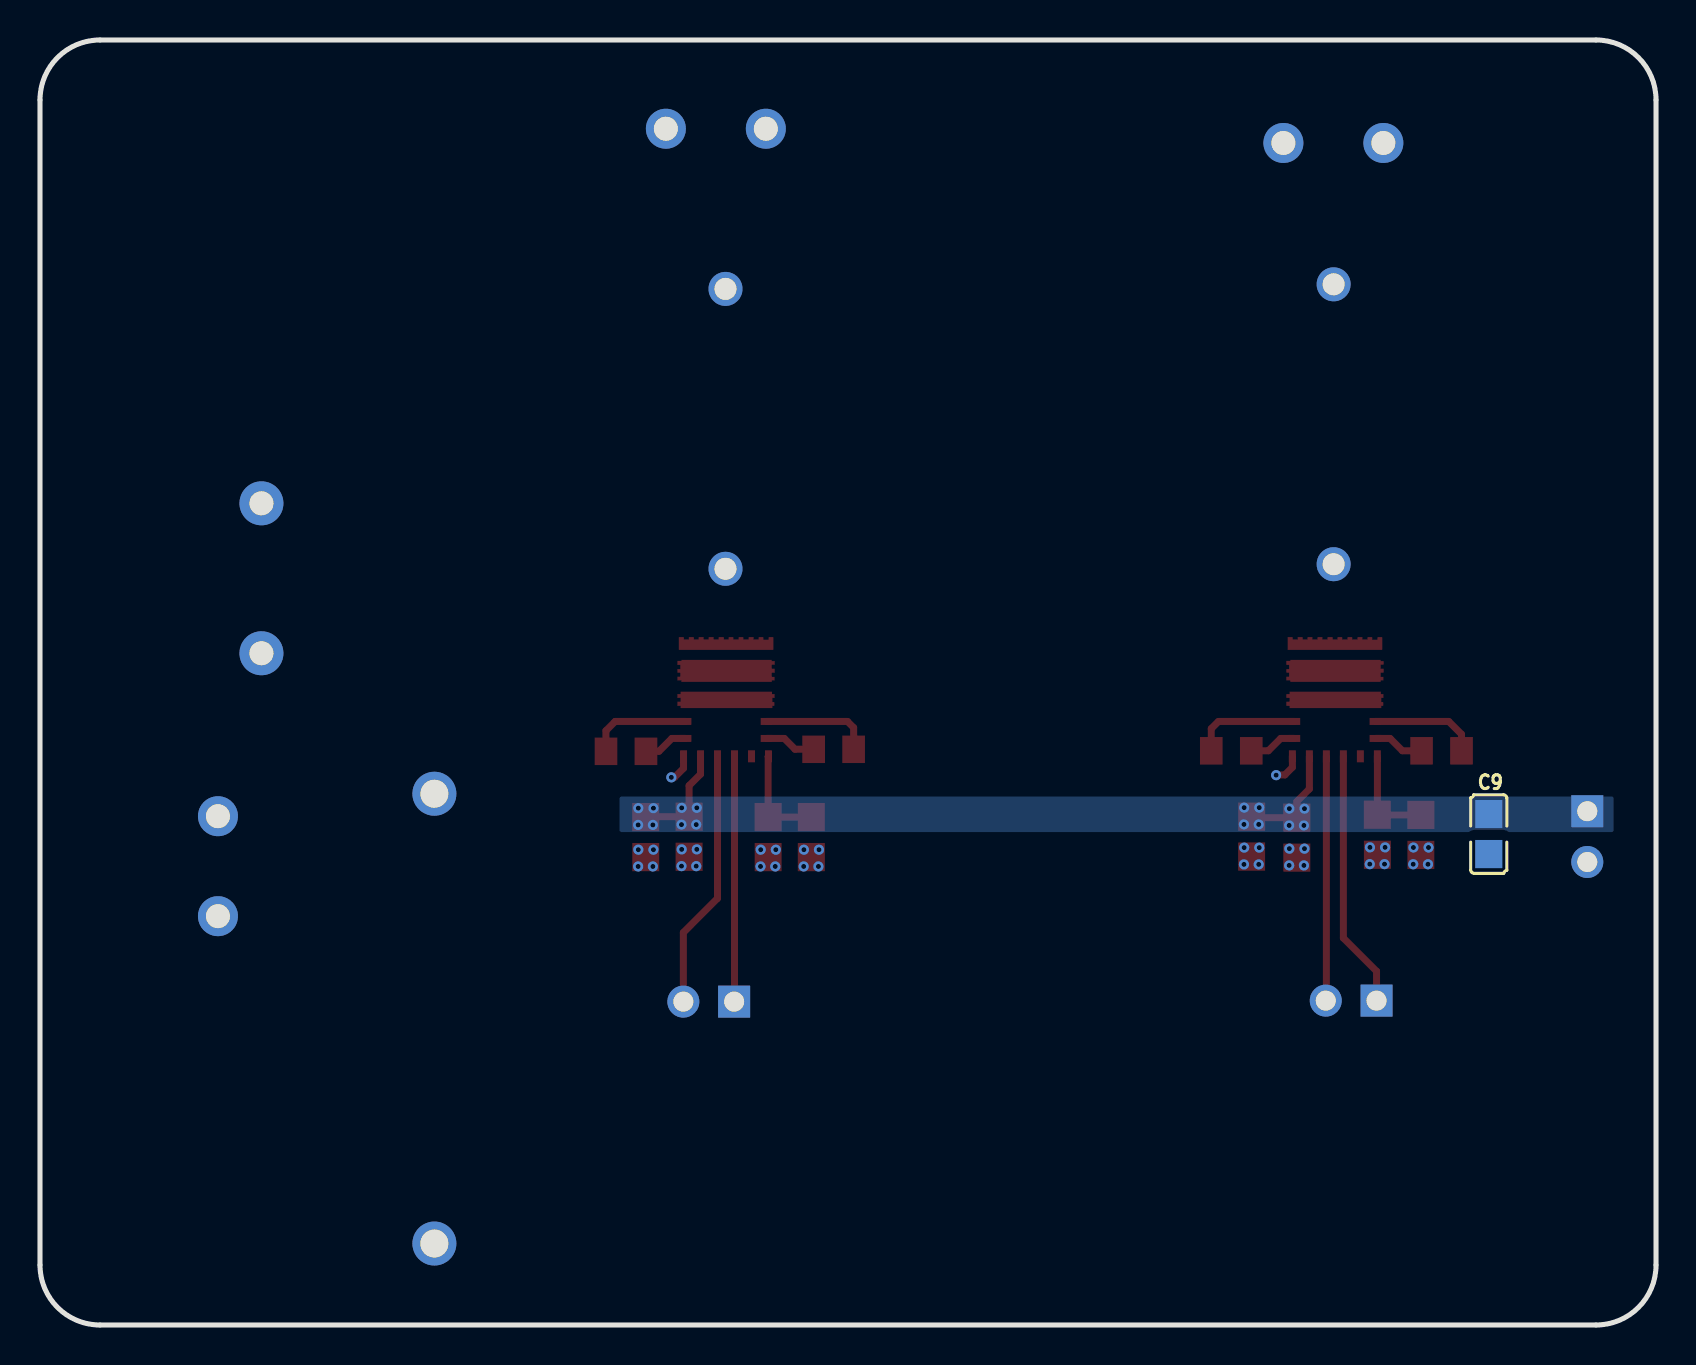
[diagram p8: board, bottom side, seen from below]

Outline 80.83 x 64.28 mm; copper layers: Top Layer, Bottom Layer. Coordinates in mm from the lower left corner of the outline.
Outline path: 0,61.28 0,3 arc(0.88,0.88) 3,0 77.83,0 arc(79.95,0.88) 80.83,3 80.83,61.28 arc(79.95,63.4) 77.83,64.28 3,64.28 arc(0.88,63.4) 0,61.28
Stack: Top Layer 0.035mm / Dielectric1 1.51mm FR4 er 4.5 / Bottom Layer 0.035mm

## Design rules (mm)
template: 自定义配置
spacing copperThickness1oz (default): track to track 0.381, other pairs 0.381 to 0.381
spacing copperThickness2oz: track to track 0.203, other pairs 0.152 to 0.3
track width copperThickness1oz (default): min 0.127, default 0.254, max 2.54
track width copperThickness2oz: min 0.203, default 0.254, max 2.54
differential pair differentialPair (default): width min 0.127, default 0.254, max 2.54; gap min 0.152, default 0.152
via viaSize (default): diameter min 0.5, default 0.508, max 10; hole min 0.127, default 0.254, max 6.3

## Placement (name value [footprint] x y rotation side)
C1  100nF  [C0805]  42.25 24.41 270 top
C2  100nF  [C0805]  44.41 24.41 270 top
C3  100nF  [C0805]  11.76 24.51 270 top
C4  100nF  [C0805]  13.94 24.52 270 top
C5  100nF  [C0805]  50.53 24.41 270 top
C6  100nF  [C0805]  48.36 24.42 270 top
C7  100nF  [C0805]  17.97 24.38 270 top
C8  100nF  [C0805]  20.23 24.43 270 top
C9  100nF  [C0805]  8.37 24.56 270 bottom
C10  470uF  [CAP-TH_BD16.0-P7.50-D1.2-FD]  69.75 37.35 90 top
C11  1uF  [CAP-TH_L26.5-W10.0-P22.50-D1.4]  61.1 15.33 270 top
CN2  CON2-2.54*2P  [CONN-TH_2P-P2.54-V]  47.38 16.18 0 top
CN3  CON2-2.54*2P  [CONN-TH_2P-P2.54-V]  3.44 24.43 270 top
CN4  CON2-2.54*2P  [CONN-TH_2P-P2.54-V]  15.25 16.23 0 top
P1  KF301-2P接线端子  [CONN-TH_XY301V-A-5.0-2P]  71.93 22.95 270 top
P2  KF301-2P接线端子  [CONN-TH_XY301V-A-5.0-2P]  47.02 59.84 0 top
P3  KF301-2P接线端子  [CONN-TH_XY301V-A-5.0-2P]  16.14 59.13 0 top
R1  2  [R0805]  41.13 28.8 0 top
R2  2  [R0805]  51.52 28.7 180 top
R3  2  [R0805]  10.73 28.72 0 top
R4  2  [R0805]  21.24 28.72 180 top
U1  ISG3202LA  [LGA-25_L6.5-W5.0-P0.85-TL]  46.52 31.24 180 top
U2  ISG3202LA  [LGA-25_L6.5-W5.0-P0.85-TL]  16.06 31.24 180 top
U3  860uH  [IND-TH_L29.0-W16.0-P14.00-D0.8]  16.12 45.06 180 top
U4  860uH  [IND-TH_L29.0-W16.0-P14.00-D0.8]  46.54 44.83 180 top

## Footprints (pads in the part's own frame, mm; a bottom-side part is the same pattern mirrored in y, then rotated)
C0805
  rect 1.41x1.35 smd: 1(-1,0) 2(1,0)
CAP-TH_BD16.0-P7.50-D1.2-FD
  round 2.2 hole 1.2: 1(-3.75,0) 2(3.75,0)
CAP-TH_L26.5-W10.0-P22.50-D1.4
  round 2.2 hole 1.4: 1(-11.249,0) 2(11.249,0)
CONN-TH_2P-P2.54-V
  rect 1.6x1.6 hole 1: 1(-1.27,0)
  round 1.6 hole 1: 2(1.27,0)
CONN-TH_XY301V-A-5.0-2P
  round 2 hole 1.2: 1(-2.5,0) 2(2.5,0)
IND-TH_L29.0-W16.0-P14.00-D0.8
  round 1.7 hole 1.1: 1(0,7) 2(0,-7)
LGA-25_L6.5-W5.0-P0.85-TL
  rect 0.6x0.35 smd: 1(-2.032,1.898) 2(-2.032,1.048) 23(2.032,1.048) 24(2.032,1.898)
  custom 4.86x0.82 smd: 3(0,-0.032)
  custom 4.87x1.1 smd: 5(0.005,-1.482)
  custom 4.73x0.64 smd: 9(0.005,-2.792)
  rect 0.35x0.6 smd: 25(2.125,2.792) 26(1.275,2.792) 27(0.425,2.792) 28(-0.425,2.792) 29(-1.275,2.792) 30(-2.125,2.792)
R0805
  rect 1.133x1.377 smd: 1(-1,0) 2(1,0)

## Nets
As in the schematic.

Pads without a net: U1 26; U2 26

## Via types
v1: diameter 0.508, hole 0.254, Top Layer to Bottom Layer, 50 vias

## Routing (per net, layer and track width the routed paths; a pad name or vN(x,y) marks a point on that pad's centre or on a via; arc(x,y) is an arc through that point)
+5V: length 11
  Top Layer w0.35: C8.1 20.18,25.38 C7.1 17.97,26.18 17.34,26.81 U2.29 ; C5.1 50.51,25.42 C6.1 48.36,26.98 47.79,27.55 U1.29
  vias: v1(17.58,25.83) v1(17.61,24.99) v1(18.34,25.83) v1(18.35,24.99) v1(19.84,25.88) v1(19.87,25.04) v1(20.6,25.88) v1(20.61,25.04) v1(47.98,25.87) v1(48.01,25.03) v1(48.73,25.87) v1(48.74,25.03) v1(50.15,25.85) v1(50.17,25.02) v1(50.9,25.85) v1(50.91,25.02)
PGND: length 2.9
  Top Layer w0.35: v1(19,27.5) 18.99,27.52 18.56,27.52 18.19,27.89 18.19,28.45 ; v1(49.25,27.39) 49.09,27.39 48.64,27.84 U1.30
  vias: v1(11.38,23.89) v1(11.41,23.05) v1(12.13,23.89) v1(12.14,23.05) v1(13.55,23.89) v1(13.58,23.05) v1(14.31,23.89) v1(14.32,23.05) v1(17.58,23.83) v1(17.61,22.99) v1(18.34,23.83) v1(18.35,22.99) v1(19.84,23.88) v1(19.87,23.04) v1(20.6,23.88) v1(20.61,23.04) v1(41.87,23.78) v1(41.89,22.94) v1(42.62,23.78) v1(42.63,22.94) v1(44.03,23.78) v1(44.05,22.94) v1(44.78,23.78) v1(44.79,22.94) v1(47.98,23.79) v1(48.01,22.95) v1(48.73,23.79) v1(48.74,22.95) v1(50.15,23.78) v1(50.17,22.94) v1(50.9,23.78) v1(50.91,22.94)
PWM1: length 12.3
  Top Layer w0.35: U1.27 46.09,16.19 CN2.1
PWM2: length 13
  Top Layer w0.35: CN2.2 48.65,19.63 46.94,21.34 U1.28
PWM3: length 12.9
  Top Layer w0.35: U2.27 15.64,19.36 13.98,17.7 13.98,16.23
PWM4: length 12.2
  Top Layer w0.35: CN4.2 16.49,16.26 U2.28
$1N1932: length 5.6
  Top Layer w0.35: R1.1 40.13,29.88 40.44,30.19 U1.23
$1N1936: length 2.6
  Top Layer w0.35: U1.24 43.6,29.34 43.06,28.8 R1.2
$1N1943: length 5.2
  Top Layer w0.35: U1.2 52.06,30.19 52.52,29.73 R2.1
$1N1948: length 2.2
  Top Layer w0.35: U1.1 49.23,29.34 49.87,28.7 R2.2
$1N2001: length 5.4
  Top Layer w0.35: R3.1 9.73,29.55 10.37,30.19 U2.23
$1N2003: length 2.6
  Top Layer w0.35: U2.24 13.3,29.34 12.68,28.72 R3.2
$1N2007: length 5.4
  Top Layer w0.35: R4.1 22.24,29.83 21.89,30.19 U2.2
$1N2009: length 2.4
  Top Layer w0.35: U2.1 18.77,29.34 19.39,28.72 R4.2
$1N2087: length 5.2
  Top Layer w0.35: U1.25 44.41,28.43 C2.1 C1.1
$1N2168: length 5.1
  Top Layer w0.35: C3.1 13.93,25.51 C4.1 13.94,28.44

## Copper pours and planes (outline as drawn; the poured copper is in the pictures)
+5V on Bottom Layer: 2.12,26.44 51.85,26.44 51.85,24.66 2.12,24.66
+VIN on Top Layer: 73.48,35.58 73.48,23.64 60.39,23.64 53.17,30.86 12.86,30.86 12.86,31.7 53.27,31.7 57.15,35.58
PGND on Top Layer: 12.85,33.3 12.85,32.18 52.93,32.18 59.55,38.8 74.35,38.8 74.35,22.71 59.39,22.71 59.35,22.68 59.35,2.25 80.01,2.25 80.01,45.25 56.28,45.25 49.95,38.92 49.95,33.28 12.88,33.28
BRIDGE1 on Top Layer: 41.79,61.06 52.69,61.06 52.69,50.14 41.79,50.14
BRIDGE2 on Top Layer: 11.39,60.65 20.96,60.65 20.96,49.7 11.39,49.7
$1N1496 on Top Layer: 13.7,33.78 18.42,33.78 18.42,38.58 17.69,39.31 14.46,39.31 13.7,38.55
$1N1511 on Top Layer: 44.15,33.78 48.88,33.78 48.88,38.58 48.14,39.31 44.92,39.31 44.15,38.55
